# EasyEDA Pro project ProPrj_FAB-O-MATIC-rev1.3_2024-08-18.epro

# Schematic FAB-O-MATIC

## Sheets
1 Schematics: Board Name: FAB-O-MATIC; Create Date: 2024-08-17; Page Name: Schematics; Project Name: FAB-O-MATIC-rev1.3; Schematic Name: FAB-O-MATIC; Update Date: 2024-08-21; Date: August, 2024; REV: 1.3
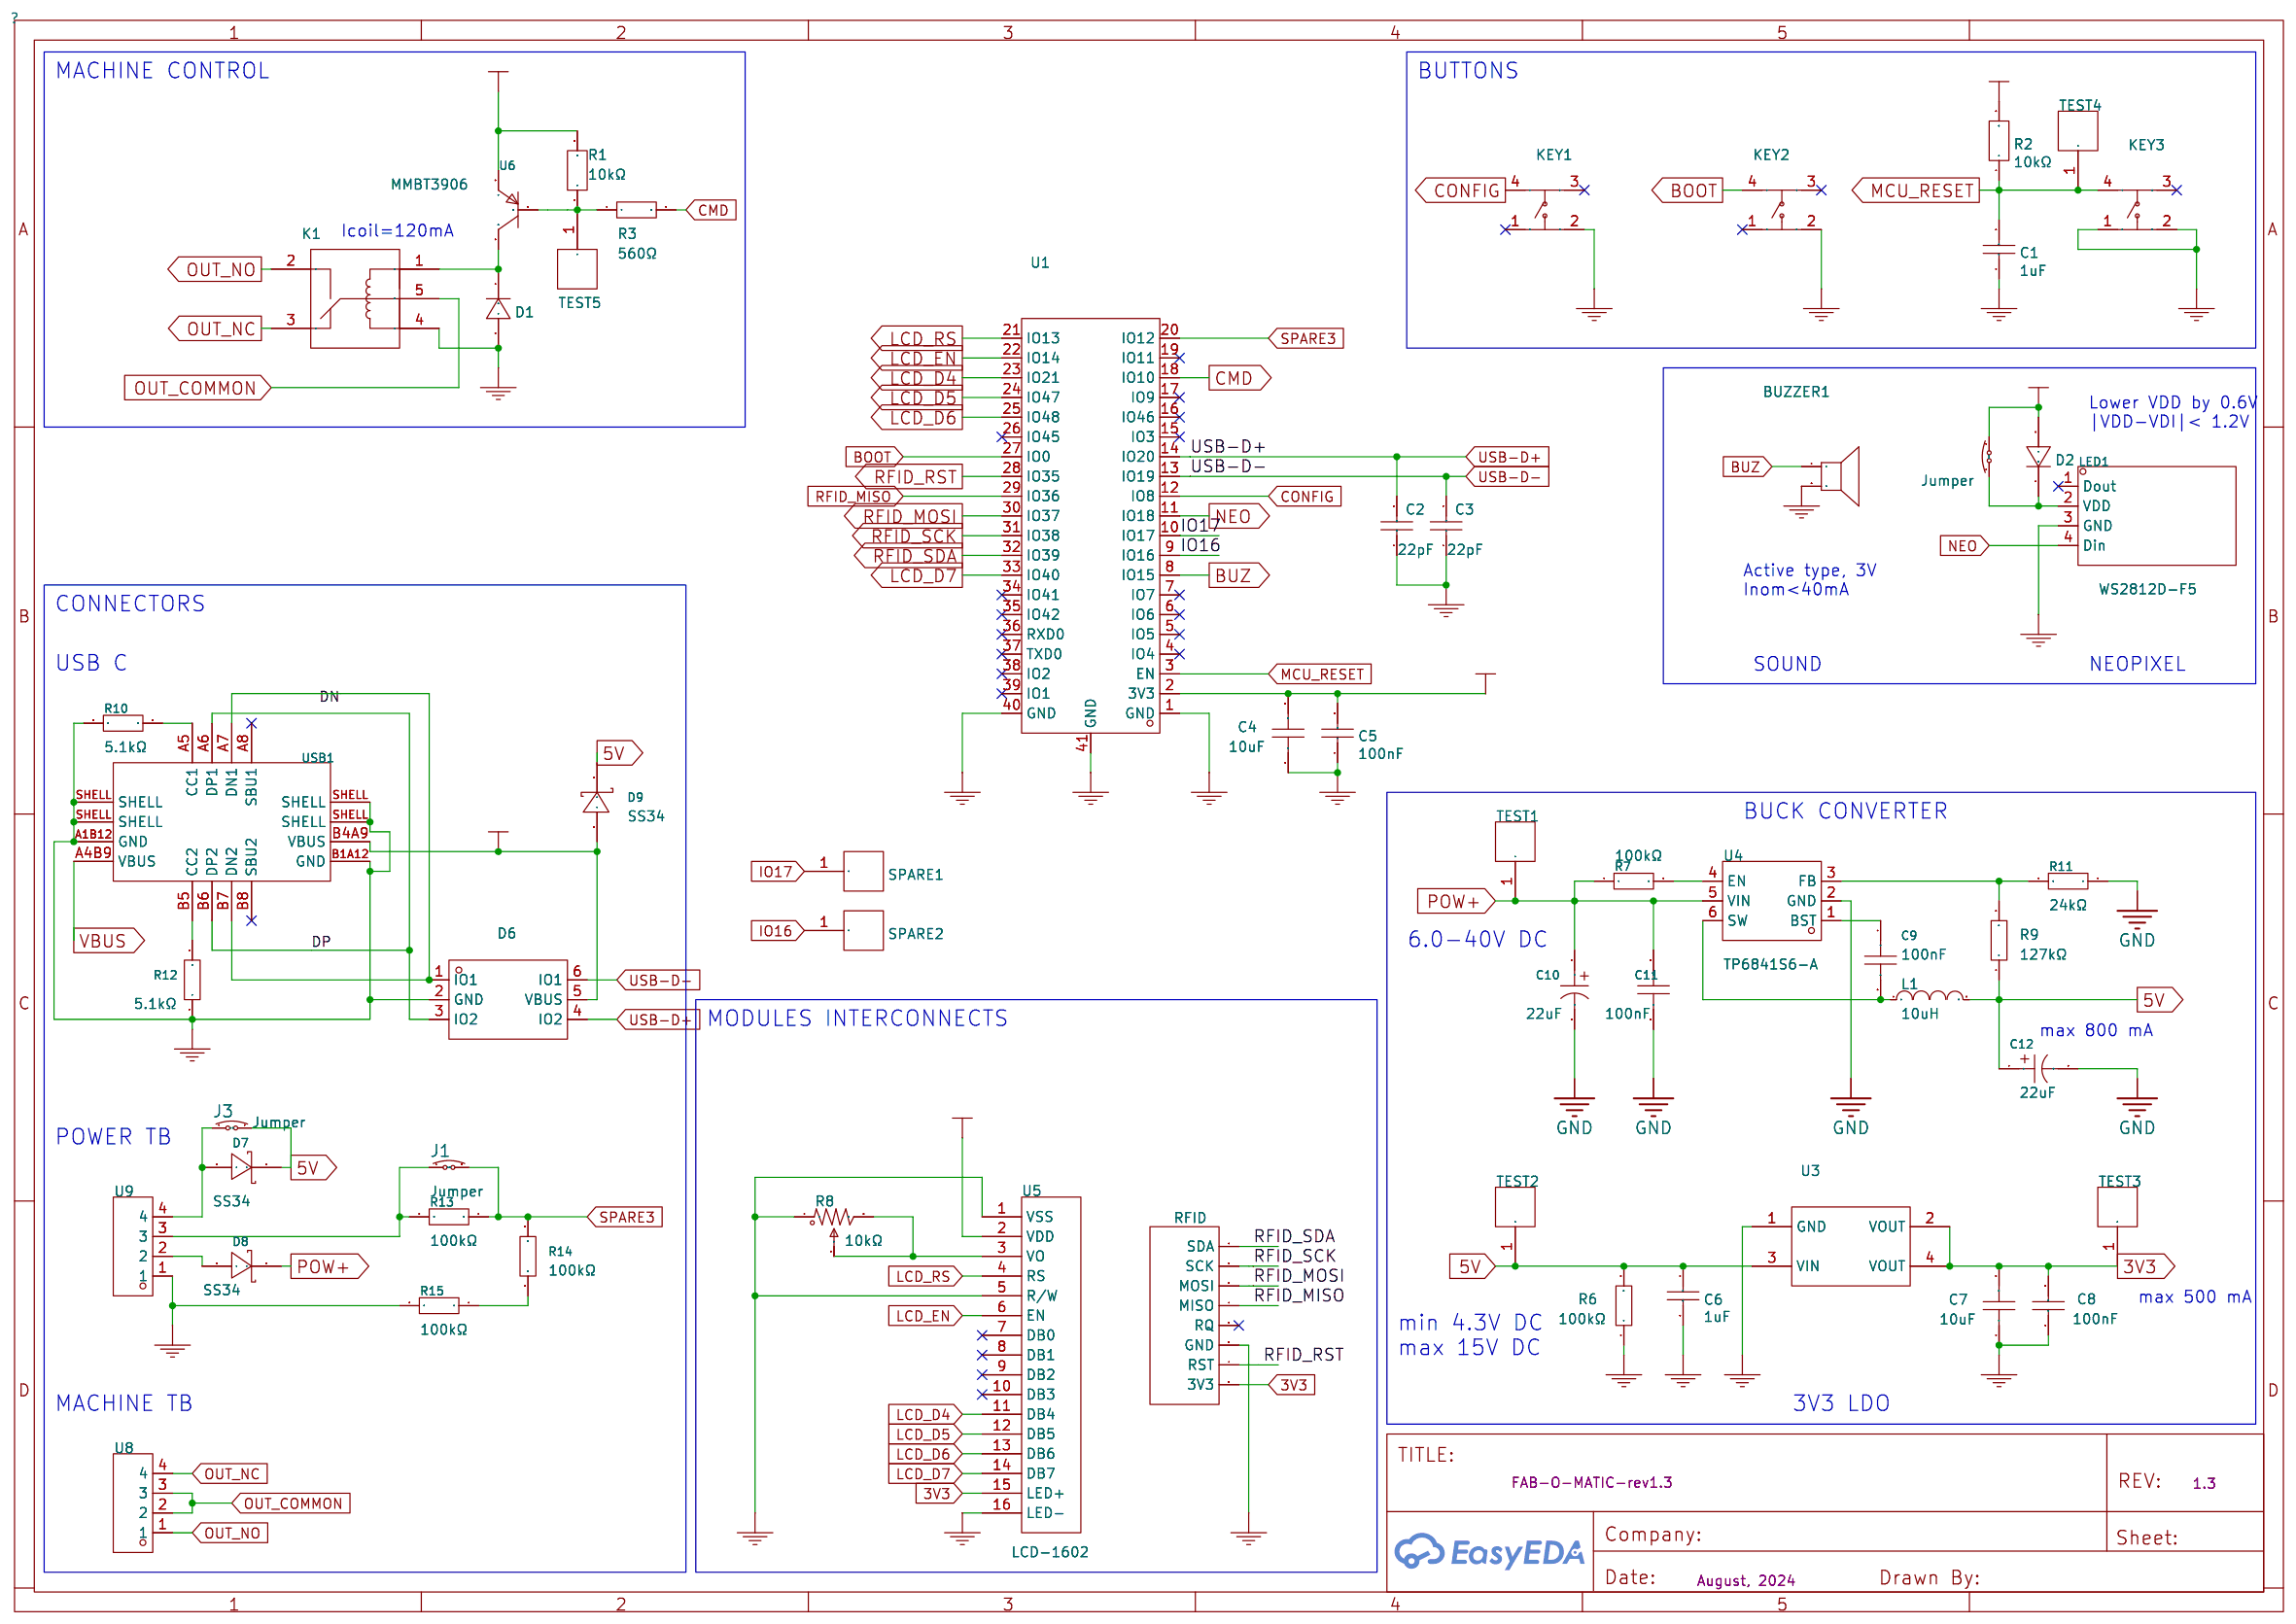
[diagram p0: Schematics]
2 Notes: Page Name: Notes; Update Date: 2024-08-17; Company: FabLab BG; Drawn: PBrunot
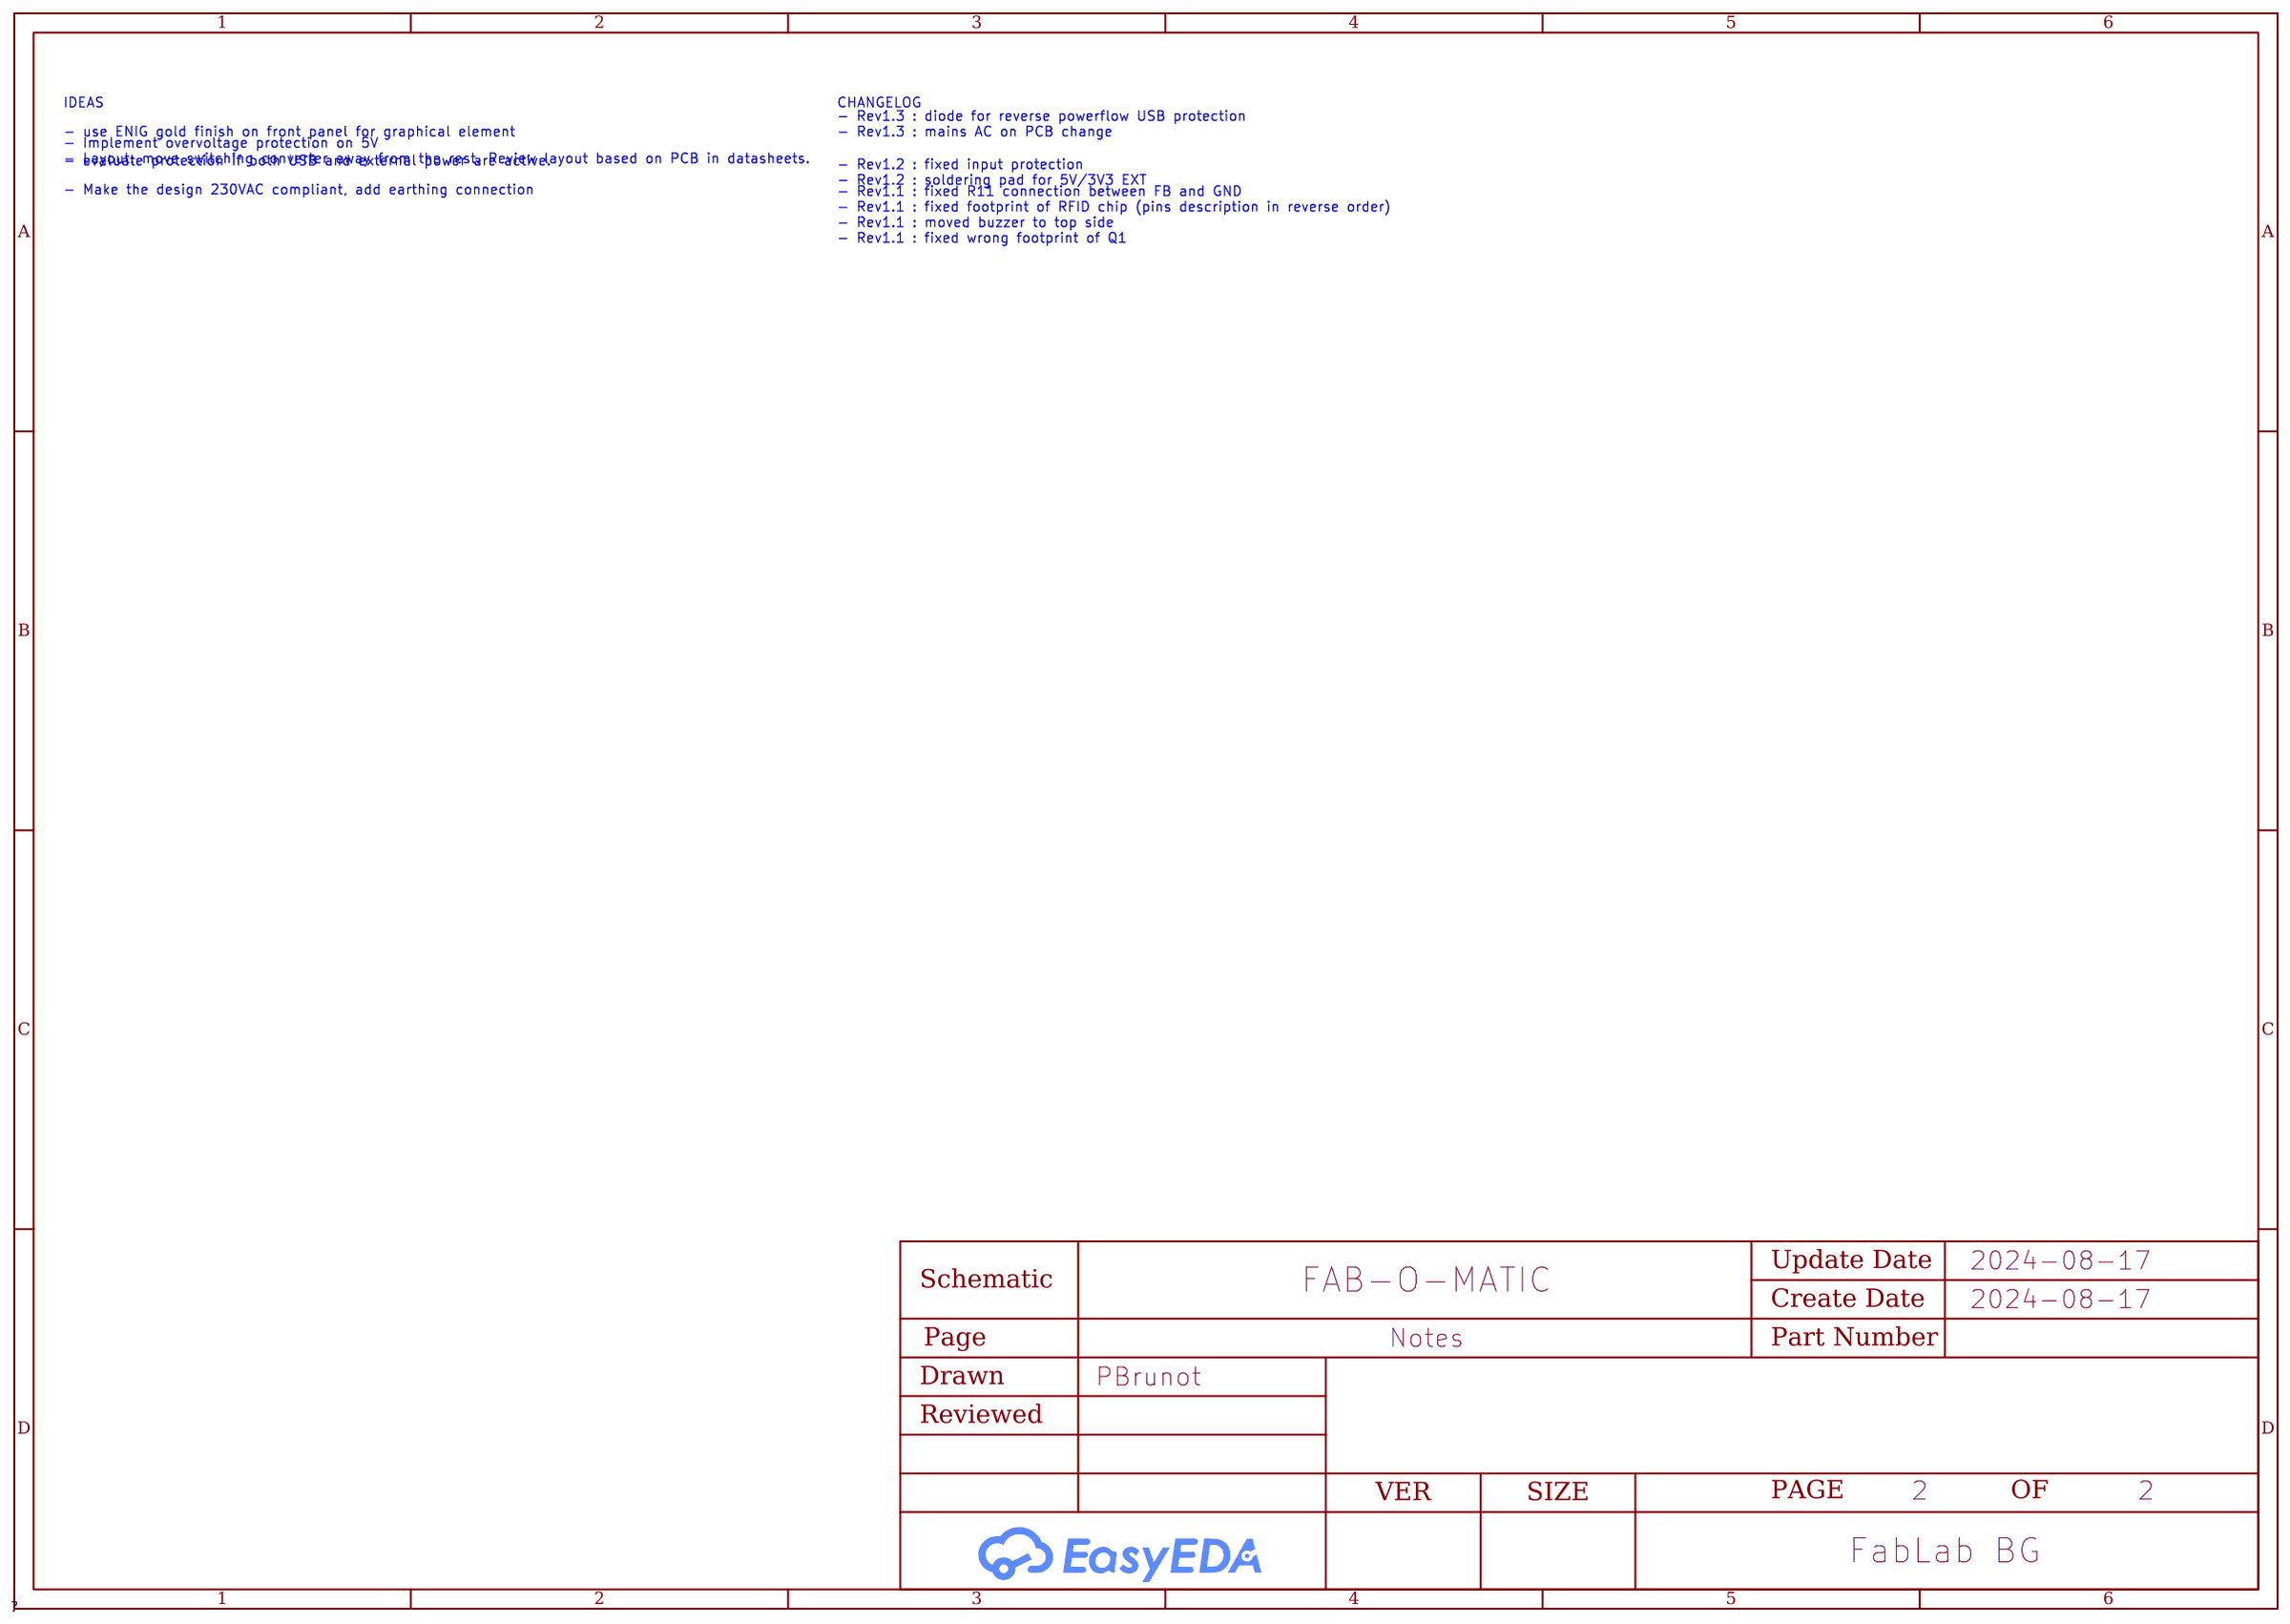
[diagram p1: Notes]

## Parts
BUZZER1  4kHz  [BUZ-TH_BD12.5-P6.50-D0.9]
C1  1uF  [C0805]
C2  22pF  [C0603]
C3  22pF  [C0603]
C4  10uF  [C0805]
C5  100nF  [C0805]
C6  1uF  [C0805]
C7  10uF  [C0805]
C8  100nF  [C0805]
C9  100nF  [C0603]
C10  22uF  [CAP-SMD_BD6.3-L6.6-W6.6-FD]
C11  100nF  [C0603]
C12  22uF  [CAP-SMD_BD6.3-L6.6-W6.6-FD]
D1  SM4007PL  [SOD-123F_L2.8-W1.8-LS3.7-RD]
D2  SM4007PL  [SOD-123F_L2.8-W1.8-LS3.7-RD]
D6  USBLC6-2SC6  [SOT-23-6_L2.9-W1.6-P0.95-LS2.8-BL]
D7  SS34  [SMA_L4.3-W2.6-LS5.2-RD]
D8  SS34  [SMA_L4.3-W2.6-LS5.2-RD]
D9  SS34  [SMA_L4.3-W2.6-LS5.2-RD]
J1  Jumper  [JUMPER]
J2  Jumper  [JUMPER]
J3  Jumper  [JUMPER]
K1  SRD-03VDC-SL-C  [RELAY-TH_SRD-03VDC-SL-C]
KEY1  TSA063G60-250  [KEY-SMD_4P-L6.1-W6.1-P4.50-LS9.0]
KEY2  TSA063G60-250  [KEY-SMD_4P-L6.1-W6.1-P4.50-LS9.0]
KEY3  TSA063G60-250  [KEY-SMD_4P-L6.1-W6.1-P4.50-LS9.0]
L1  10uH  [IND-SMD_L4.0-W4.0]
LED1  WS2812D-F5  [LED-TH_4P-BD5.8-P1.30]
P1  RFID  [footprint_17af]
R1  10kΩ  [R0805]
R2  10kΩ  [R0805]
R3  560Ω  [R0805]
R6  100kΩ  [R0805]
R7  100kΩ  [R0603]
R8  10kΩ  [RES-ADJ-TH_3362P]
R9  127kΩ  [R0603]
R10  5.1kΩ  [R0603]
R11  24kΩ  [R0603]
R12  5.1kΩ  [R0603]
R13  100kΩ  [R0603]
R14  100kΩ  [R0603]
R15  100kΩ  [R0603]
SPARE1  0577-0-43-80-21-27-10-0  [footprint_662d]  (no BOM)
SPARE2  0577-0-43-80-21-27-10-0  [footprint_662d]  (no BOM)
TEST1  0577-0-43-80-21-27-10-0  [footprint_662d]  (no BOM)
TEST2  0577-0-43-80-21-27-10-0  [footprint_662d]  (no BOM)
TEST3  0577-0-43-80-21-27-10-0  [footprint_662d]  (no BOM)
TEST4  0577-0-43-80-21-27-10-0  [footprint_662d]  (no BOM)
TEST5  0577-0-43-80-21-27-10-0  [footprint_662d]  (no BOM)
U1  ESP32-S3-WROOM-1-N4R8  [WIRELM-SMD_ESP32-S3-WROOM-1]
U3  LD1117S33TR  [SOT-223_L6.5-W3.5-P2.30-LS7.0-BR]
U4  TP6841S6-A  [SOT-23-6_L2.9-W1.6-P0.95-LS2.8-BL]
U5  LCD-1602  [footprint_8a57]
U6  MMBT3906  [SOT-23-3_L2.9-W1.3-P1.90-LS2.4-BR]
U8  DB103-5.0-4P-GN-S  [CONN-TH_4P-P5.00_DB103-5.0-4P-GN-S]
U9  DB103-5.0-4P-GN-S  [CONN-TH_4P-P5.00_DB103-5.0-4P-GN-S]
USB1  U262-161N-4BVC11  [USB-3.1-SMD_U262-161N-4BVC11]

## Library data of the parts
BUZZER1 = SFN-12055PA6.5_C360607: Oscillator Circuit:无源(外部驱动) Technology Type:压电式 Frequency:4kHz Sound Pressure Level (SPL):80dB@5V,10cm Diameter (φD):12.5mm Height:6mm; LCSC Part Name: 压电无源蜂鸣器; Supplier Part: C360607; Manufacturer: S&S(海旭); Manufacturer Part: SFN-12055PA6.5; Supplier Footprint: 插件,D=12.5mm; JLCPCB Part Class: Extended Part; Datasheet: https://atta.szlcsc.com/upload/public/pdf/source/20220225/D801AF3A55A67CFB490E002F7E7725D1.pdf; Supplier: LCSC; Oscillator Circuit: 无源(外部驱动); Technology Type: 压电式; Sound Pressure Level (SPL): 80dB@5V,10cm; Diameter (φD): 12.5mm; Height: 6mm
C1 C6 = CL21B105KBFNNNE: Capacitance: Tolerance:±10% Tolerance:±10% Voltage Rated: Temperature Coefficient:; LCSC Part Name: 1uF ±10% 50V; Supplier Part: C28323; Manufacturer: SAMSUNG(三星); Supplier Footprint: 0805; JLCPCB Part Class: Basic Part; Datasheet: https://atta.szlcsc.com/upload/public/pdf/source/20160218/1457707763339.pdf; Supplier: LCSC; Tolerance: ±10%
C2 C3 = CL10C220JB8NNNC: Capacitance: Tolerance:±5% Tolerance:±5% Voltage Rated: Temperature Coefficient:; LCSC Part Name: 22pF ±5% 50V; Supplier Part: C1653; Manufacturer: SAMSUNG(三星); Supplier Footprint: 0603; JLCPCB Part Class: Basic Part; Datasheet: https://atta.szlcsc.com/upload/public/pdf/source/20160218/1457707763339.pdf; Supplier: LCSC; Tolerance: ±5%
C4 C7 = GRM21BR61H106KE43L: Capacitance: Tolerance:±10% Tolerance:±10% Voltage Rated: Temperature Coefficient:; LCSC Part Name: 10uF ±10% 50V; Supplier Part: C440198; Manufacturer: muRata(村田); Supplier Footprint: 0805; JLCPCB Part Class: Basic Part; Datasheet: https://atta.szlcsc.com/upload/public/pdf/source/20230811/95AAE0C9AF55EDC31B7A4D8B733F534E.pdf; Supplier: LCSC; Tolerance: ±10%
C5 C8 = CL21B104KCFNNNE: Capacitance: Tolerance:±10% Tolerance:±10% Voltage Rated: Temperature Coefficient:; LCSC Part Name: 100nF ±10% 100V; Supplier Part: C28233; Manufacturer: SAMSUNG(三星); Supplier Footprint: 0805; JLCPCB Part Class: Basic Part; Datasheet: https://atta.szlcsc.com/upload/public/pdf/source/20160218/1457707763339.pdf; Supplier: LCSC; Tolerance: ±10%
C9 C11 = CC0603KRX7R9BB104: Capacitance: Tolerance:±10% Tolerance:±10% Voltage Rated: Temperature Coefficient:; LCSC Part Name: 100nF ±10% 50V; Supplier Part: C14663; Manufacturer: YAGEO(国巨); Supplier Footprint: 0603; JLCPCB Part Class: Basic Part; Datasheet: https://atta.szlcsc.com/upload/public/pdf/source/20180910/C282072_33301C7F631E79921B82A8DAC6BCC5B3.pdf; Supplier: LCSC; Tolerance: ±10%
C10 C12 = RVT22UF50V67RV0028: Capacitance: Tolerance:±20% Tolerance:±20% Rated Voltage: Ripple Current:43mA@120Hz Equivalent Series Resistance(ESR):- φD: L: Lifetime @ Temp:2000hrs@105℃ Operating Temperature:-55℃~+105℃ Operating Temperature:-55℃~+105℃; LCSC Part Name: 22uF ±20% 50V; Supplier Part: C2836438; Manufacturer: KNSCHA(科尼盛); Supplier Footprint: SMD,D6.3xL5.4mm; JLCPCB Part Class: Extended Part; Datasheet: https://atta.szlcsc.com/upload/public/pdf/source/20210528/C2836438_BFA13B3627CC6B20ADD0B3BB98082A71.pdf; Supplier: LCSC; Tolerance: ±20%; Ripple Current: 43mA@120Hz; Lifetime @ Temp: 2000hrs@105℃; Operating Temperature: -55℃~+105℃
D1 D2 = SM4007PL_C64898: Diode Configuration: Forward Voltage (Vf@If):1.1V@1A Reverse Voltage (Vr): Average Rectified Current (Io): Reverse Leakage Current:10uA@1kV; LCSC Part Name: 电压:1kV 电流:1A; Supplier Part: C64898; Manufacturer: MDD; Supplier Footprint: SOD-123FL; JLCPCB Part Class: Basic Part; Datasheet: https://atta.szlcsc.com/upload/public/pdf/source/20230823/16A8FDE162764C9B685A3717F2DA3690.pdf; Supplier: LCSC; Forward Voltage (Vf@If): 1.1V@1A; Reverse Leakage Current: 10uA@1kV
D6 = USBLC6-2SC6_C2827654: polarity:- Reverse Stand-Off Voltage (Vrwm):- Maximum Clamping Voltage:- Peak Pulse Current (Ipp)@10/1000us:- Peak Pulse Power Dissipation (Ppp)@10/1000us:- Breakdown Voltage:- Reverse Leakage Current (Ir):- Operating Temperature:- Operating Temperature:-; LCSC Part Name: ESD，可防30kV静电; Supplier Part: C2827654; Manufacturer: TECH PUBLIC(台舟); Supplier Footprint: SOT-23-6; JLCPCB Part Class: Extended Part; Datasheet: https://atta.szlcsc.com/upload/public/pdf/source/20210810/FBD75DE717D6D97BAC6DD7F2B5C09DCD.pdf; Supplier: LCSC; Type: ESD
D7-D9 = SS34_C8678: Diode Configuration:Single Forward Voltage (Vf@If):550mV@3A Reverse Voltage (Vr):40V Average Rectified Current (Io):3A Reverse Leakage Current (Ir):500uA@40V; LCSC Part Name: 电压:40V 电流:3A; Supplier Part: C8678; Manufacturer: MDD; Supplier Footprint: SMA(DO-214AC); JLCPCB Part Class: Basic Part; Datasheet: https://atta.szlcsc.com/upload/public/pdf/source/20230314/A80AE34493C69B89E2F4B1712F433538.pdf; Supplier: LCSC; Diode Configuration: Single; Forward Voltage (Vf@If): 550mV@3A; Reverse Voltage (Vr): 40V; Average Rectified Current (Io): 3A; Reverse Leakage Current (Ir): 500uA@40V
J1-J3 = Jumper
K1 = SRD-03VDC-SL-C: Coil Voltage:3V Contact Form:一组转换:1C(SPDT-转换) Pin Number:5 Contact Rating:- Maximum Switching Voltage:250V@AC Coil Rated Power:360mW Maximum Switching Current:15A Coil Type:无极性-单线圈 Contact Resistance:100mΩ Operate Time:10ms Release Time:10ms; LCSC Part Name: 3V继电器 单刀双掷 蓝色; Supplier Part: C496430; Manufacturer: 松乐; Supplier Footprint: 插件,15.6x19.2mm; JLCPCB Part Class: Extended Part; Datasheet: https://atta.szlcsc.com/upload/public/pdf/source/20211029/0AF1F09028F3938DCCE87F54F358E4BA.pdf; Supplier: LCSC; Coil Voltage: 3V; Contact Form: 一组转换:1C(SPDT-转换); Pin Number: 5; Maximum Switching Voltage: 250V@AC; Coil Rated Power: 360mW; Maximum Switching Current: 15A; Coil Type: 无极性-单线圈; Contact Resistance: 100mΩ; Operate Time: 10ms; Release Time: 10ms
KEY1-KEY3 = TSA063G60-250: Circuit:SPST Actuator Style:Round Button Operating Force:250gf Mounting Style:Brick nogging Switch Length:6.1mm Switch Width:6.1mm Switch Height:6mm Strike Gundam:不带 Contact Current:50mA Voltage Rating (DC):12V Insulation Resistance:100MΩ Actuator/Cap Col; LCSC Part Name: 6.1*6.1*6mm 立贴 轻触开关; Supplier Part: C294566; Manufacturer: BRIGHT(博瑞泰); Supplier Footprint: SMD; JLCPCB Part Class: Extended Part; Datasheet: https://atta.szlcsc.com/upload/public/pdf/source/20181029/C294570_15EFF1F4D215547575AD6307D8A439BB.pdf; Supplier: LCSC; Circuit: SPST; Actuator Style: Round Button; Operating Force: 250gf; Mounting Style: Brick nogging; Switch Length: 6.1mm; Switch Width: 6.1mm; Switch Height: 6mm; Strike Gundam: 不带; Contact Current: 50mA; Voltage Rating (DC): 12V; Insulation Resistance: 100MΩ; Actuator/Cap Color: Black; With Lamp: No; Pin Style: Gull Wing; Mechanical Life: 5万次; Operating Temperature: -25℃~+70℃
L1 = SWPA4030S100MT: Inductance: Tolerance:±20% Tolerance:±20% Rated Current: Saturation Current (Isat):2.4A DC Resistance (DCR): Type:- Ratings:-; LCSC Part Name: 10uH ±20% 2.4A; Supplier Part: C38117; Manufacturer: Sunlord(顺络); Supplier Footprint: SMD; JLCPCB Part Class: Extended Part; Datasheet: https://atta.szlcsc.com/upload/public/pdf/source/20231024/317626D2AA2F8AB4113C1875E432E6E1.pdf; Supplier: LCSC; Tolerance: ±20%; Saturation Current (Isat): 2.4A
LED1 = WS2812D-F5: Lamp Holder Type:5mm圆形灯头; Supplier Part: C190565; Manufacturer: worldsemi; Supplier Footprint: 插件,D=5mm; JLCPCB Part Class: Extended Part; Datasheet: https://atta.szlcsc.com/upload/public/pdf/source/20220418/4832EF9FB0C1B68C1F4176435955B165.pdf; Supplier: LCSC; Lamp Holder Type: 5mm圆形灯头
P1 = RFID: Supplier Part: C27438; Supplier: LCSC; Manufacturer: BOOMELE; Manufacturer Part: Female headerHDR1X8-2.54
R1 R2 = 0805W8F1002T5E: Type:Thick Film Resistors Resistance:10kΩ Tolerance:±1% Tolerance:±1% Power(Watts): Overload Voltage (Max): Temperature Coefficient:±100ppm/℃ Temperature Coefficient:±100ppm/℃ Operating Temperature Range:-55℃~+155℃ Operating Temperature Range:-55℃~+155℃; LCSC Part Name: 10kΩ ±1% 125mW 厚膜电阻; Supplier Part: C17414; Manufacturer: UNI-ROYAL(厚声); Supplier Footprint: 0805; JLCPCB Part Class: Basic Part; Datasheet: https://atta.szlcsc.com/upload/public/pdf/source/20200306/C422600_1E6D84923E4A46A82E41ADD87F860B5C.pdf; Supplier: LCSC; Type: Thick Film Resistors; Tolerance: ±1%; Temperature Coefficient: ±100ppm/℃; Operating Temperature Range: -55℃~+155℃
R3 = 0805W8F5600T5E: Type:Thick Film Resistors Resistance: Tolerance:±1% Tolerance:±1% Power(Watts): Overload Voltage (Max): Temperature Coefficient:±100ppm/℃ Temperature Coefficient:±100ppm/℃ Operating Temperature Range:-55℃~+155℃ Operating Temperature Range:-55℃~+155℃; LCSC Part Name: 560Ω ±1% 125mW 厚膜电阻; Supplier Part: C28636; Manufacturer: UNI-ROYAL(厚声); Supplier Footprint: 0805; JLCPCB Part Class: Basic Part; Datasheet: https://atta.szlcsc.com/upload/public/pdf/source/20200306/C422600_1E6D84923E4A46A82E41ADD87F860B5C.pdf; Supplier: LCSC; Type: Thick Film Resistors; Tolerance: ±1%; Temperature Coefficient: ±100ppm/℃; Operating Temperature Range: -55℃~+155℃
R6 = 0805W8F1003T5E: Type:Thick Film Resistors Resistance:100kΩ Tolerance:±1% Tolerance:±1% Power(Watts): Overload Voltage (Max): Temperature Coefficient:±100ppm/℃ Temperature Coefficient:±100ppm/℃ Operating Temperature Range:-55℃~+155℃ Operating Temperature Range:-55℃~+155℃; LCSC Part Name: 100kΩ ±1% 125mW 厚膜电阻; Supplier Part: C149504; Manufacturer: UNI-ROYAL(厚声); Supplier Footprint: 0805; JLCPCB Part Class: Basic Part; Datasheet: https://atta.szlcsc.com/upload/public/pdf/source/20200306/C422600_1E6D84923E4A46A82E41ADD87F860B5C.pdf; Supplier: LCSC; Type: Thick Film Resistors; Tolerance: ±1%; Temperature Coefficient: ±100ppm/℃; Operating Temperature Range: -55℃~+155℃
R7 R13-R15 = 0603WAF1003T5E: Type:Thick Film Resistors Resistance:100kΩ Tolerance:±1% Tolerance:±1% Power(Watts): Overload Voltage (Max): Temperature Coefficient:±100ppm/℃ Temperature Coefficient:±100ppm/℃ Operating Temperature Range:-55℃~+155℃ Operating Temperature Range:-55℃~+155℃; LCSC Part Name: 100kΩ ±1% 100mW 厚膜电阻; Supplier Part: C25803; Manufacturer: UNI-ROYAL(厚声); Supplier Footprint: 0603; JLCPCB Part Class: Basic Part; Datasheet: https://atta.szlcsc.com/upload/public/pdf/source/20200306/C422600_1E6D84923E4A46A82E41ADD87F860B5C.pdf; Supplier: LCSC; Type: Thick Film Resistors; Tolerance: ±1%; Temperature Coefficient: ±100ppm/℃; Operating Temperature Range: -55℃~+155℃
R8 = 3362P-1-103_C118956: Resistance: Tolerance:±10% Tolerance:±10%; LCSC Part Name: 10kΩ ±10%; Supplier Part: C118956; Manufacturer: BOCHEN(博晨); Manufacturer Part: 3362P-1-103; Supplier Footprint: 插件; JLCPCB Part Class: Extended Part; Datasheet: https://atta.szlcsc.com/upload/public/pdf/source/20171114/C118956_15106326650691117445.pdf; Supplier: LCSC; Tolerance: ±10%
R9 = RC0603FR-07127KL: Type:Thick Film Resistors Resistance: Tolerance:±1% Tolerance:±1% Power(Watts): Overload Voltage (Max): Temperature Coefficient:±100ppm/℃ Temperature Coefficient:±100ppm/℃ Operating Temperature Range:-55℃~+155℃ Operating Temperature Range:-55℃~+155℃; LCSC Part Name: 厚膜电阻 127kΩ ±1% 100mW; Supplier Part: C245905; Manufacturer: YAGEO(国巨); Supplier Footprint: 0603; JLCPCB Part Class: Extended Part; Datasheet: https://atta.szlcsc.com/upload/public/pdf/source/20181031/C326976_E9901E35333D136A19B6CE377E889A82.pdf; Supplier: LCSC; Type: Thick Film Resistors; Tolerance: ±1%; Temperature Coefficient: ±100ppm/℃; Operating Temperature Range: -55℃~+155℃
R10 R12 = 0603WAF5101T5E: Type:Thick Film Resistors Resistance:5.1kΩ Tolerance:±1% Tolerance:±1% Power(Watts): Overload Voltage (Max): Temperature Coefficient:±100ppm/℃ Temperature Coefficient:±100ppm/℃ Operating Temperature Range:-55℃~+155℃ Operating Temperature Range:-55℃~+155℃; LCSC Part Name: 5.1kΩ ±1% 100mW 厚膜电阻; Supplier Part: C23186; Manufacturer: UNI-ROYAL(厚声); Supplier Footprint: 0603; JLCPCB Part Class: Basic Part; Datasheet: https://atta.szlcsc.com/upload/public/pdf/source/20200306/C422600_1E6D84923E4A46A82E41ADD87F860B5C.pdf; Supplier: LCSC; Type: Thick Film Resistors; Tolerance: ±1%; Temperature Coefficient: ±100ppm/℃; Operating Temperature Range: -55℃~+155℃
R11 = 0603WAF2402T5E: Type:Thick Film Resistors Resistance:24kΩ Tolerance:±1% Tolerance:±1% Power(Watts): Overload Voltage (Max): Temperature Coefficient:±100ppm/℃ Temperature Coefficient:±100ppm/℃ Operating Temperature Range:-55℃~+155℃ Operating Temperature Range:-55℃~+155℃; LCSC Part Name: 24kΩ ±1% 100mW 厚膜电阻; Supplier Part: C23352; Manufacturer: UNI-ROYAL(厚声); Supplier Footprint: 0603; JLCPCB Part Class: Basic Part; Datasheet: https://atta.szlcsc.com/upload/public/pdf/source/20200306/C422600_1E6D84923E4A46A82E41ADD87F860B5C.pdf; Supplier: LCSC; Type: Thick Film Resistors; Tolerance: ±1%; Temperature Coefficient: ±100ppm/℃; Operating Temperature Range: -55℃~+155℃
SPARE1 SPARE2 TEST1-TEST5 = 0577-0-43-80-21-27-10-0: Supplier: LCSC; Supplier Part: C2895400; Manufacturer: null; JLCPCB Part Class: Extended Part
U1 = ESP32-S3-WROOM-1-N4R8: LCSC Part Name: 通用型Wi-Fi+低功耗蓝牙MCU模组; Supplier Part: C2913200; Manufacturer: ESPRESSIF(乐鑫); Supplier Footprint: SMD,18x25.5mm; JLCPCB Part Class: Extended Part; Datasheet: https://atta.szlcsc.com/upload/public/pdf/source/20220628/A2AC12B3C87735CAEB7EBE2DBE80936C.pdf; Supplier: LCSC; spicePre: U
U3 = LD1117S33TR: Output Type: Maximum Input Voltage:15V Output Voltage:3.3V Output Voltage:3.3V MAX Output Current:800mA Power Supply Rejection Ratio (PSRR):75dB@(120Hz) Dropout Voltage:1.2V@(800mA) standby current:10mA Operating Temperature:0℃~+125℃ Operating Temperature; LCSC Part Name: 输入15V 输出3.3V 800mA; Supplier Part: C86781; Manufacturer: ST(意法半导体); Supplier Footprint: SOT-223; JLCPCB Part Class: Extended Part; Datasheet: https://atta.szlcsc.com/upload/public/pdf/source/20181022/C283467_00098992BB1D287195B66486CE33A2DD.pdf; Supplier: LCSC; Maximum Input Voltage: 15V; Output Voltage: 3.3V; MAX Output Current: 800mA; Power Supply Rejection Ratio (PSRR): 75dB@(120Hz); Dropout Voltage: 1.2V@(800mA); standby current: 10mA; Operating Temperature: 0℃~+125℃; Output Polarity: Positive electrode; Number of Outputs: 1
U4 = TP6841S6-A: Supplier Part: C2844924; Manufacturer: TECH PUBLIC(台舟); Supplier Footprint: SOT-23-6; JLCPCB Part Class: Extended Part; Datasheet: https://atta.szlcsc.com/upload/public/pdf/source/20210709/C2844924_E200F0B809810750A1B5AEDD4B4FD840.pdf; Supplier: LCSC
U5 = LCD-1602: Manufacturer Part: ?
U6 = MMBT3906_C7420354: Transistor Type:PNP Collector Current (Ic):200mA Collector-Emitter Breakdown Voltage (Vceo):40V Power Dissipation (Pd): DC Current Gain (hFE@Ic,Vce):100@10mA,1.0V DC Current Gain (hFE@Ic,Vce):100@10mA,1.0V Transition Frequency (fT):300MHz Collector Cut-Of; LCSC Part Name: 耐压:40V 电流:200mA PNP; Supplier Part: C7420354; Manufacturer: 宏迦橙; Supplier Footprint: SOT-23; JLCPCB Part Class: Extended Part; Datasheet: https://atta.szlcsc.com/upload/public/pdf/source/20231222/C57AF7F09D8B4437DE7730975D81C46C.pdf; Supplier: LCSC; Transistor Type: PNP; Collector Current (Ic): 200mA; Collector-Emitter Breakdown Voltage (Vceo): 40V; DC Current Gain (hFE@Ic,Vce): 100@10mA,1.0V; Transition Frequency (fT): 300MHz; Collector Cut-Off Current (Icbo): 100nA; Collector-Emitter Saturation Voltage (VCE(sat)@Ic,Ib): 300mV@50mA,5.0mA; Operating Temperature: -55℃~+150℃
U8 U9 = DB103-5.0-4P-GN-S: Structure:1x4P Pitch:5mm Color:Green Mounting Style:Straight Current Rating (Max):18A Voltage Rating (Max):250V Number of Pins:4P Number of Rows:1 Wire Gauge - AWG:12~24 Wire Gauge - AWG:12~24 Wire Gauge - mm2:2.5 Wire Gauge - mm2:2.5 Number of PINs Per R; LCSC Part Name: 5mm 1x4P 排数:1 每排P数:4 直插; Supplier Part: C430585; Manufacturer: DORABO(地博电气); Supplier Footprint: 插件,P=5mm; JLCPCB Part Class: Extended Part; Datasheet: https://atta.szlcsc.com/upload/public/pdf/source/20230106/752C703EF48364998289896F4CC52B88.pdf; Supplier: LCSC; Structure: 1x4P; Pitch: 5mm; Color: Green; Mounting Style: Straight; Current Rating (Max): 18A; Voltage Rating (Max): 250V; Number of Pins: 4P; Number of Rows: 1; Wire Gauge - AWG: 12~24; Wire Gauge - mm2: 2.5; Number of PINs Per Row: 4; Operating Temperature Range: -40℃~+105℃
USB1 = U262-161N-4BVC11: Connector Type:Type-C Standard:USB 3.1 Gender:Female Number of Ports:1 Number of Contacts:16P Mounting Style:卧贴 Current Rating - Power (Max):3A Contact Material:Copper Alloy Contact Plating:Gold Operating Temperature Range:-40℃~+85℃ Operating Temperature; LCSC Part Name: Type-C 母 卧贴; Supplier Part: C319148; Manufacturer: XKB Connectivity(中国星坤); Supplier Footprint: SMD; JLCPCB Part Class: Extended Part; Datasheet: https://atta.szlcsc.com/upload/public/pdf/source/20211015/B478CBA0F1623DA36A6CC6918C49C838.pdf; Supplier: LCSC; Connector Type: Type-C; Standard: USB 3.1; Gender: Female; Number of Ports: 1; Number of Contacts: 16P; Mounting Style: 卧贴; Current Rating - Power (Max): 3A; Contact Material: Copper Alloy; Contact Plating: Gold; Operating Temperature Range: -40℃~+85℃; Soldering Temperature(Max): 260℃

## Nets
3V3: C4.2 C5.2 C7.2 C8.2 P1.8(3V3) R1.2 R2.2 TEST3.1 U1.2(3V3) U3.2(VOUT) U3.4(VOUT) U5.15(LED+) U6.2(E)
5V: C6.1 C12.1 D2.2(A) D7.1(K) D9.1(K) J2.2 J3.2 L1.2 R6.2 R9.1 TEST2.1 U3.3(VIN) U5.2(VDD)
GND: BUZZER1.2 C1.1 C2.1 C3.1 C4.1 C5.1 C6.2 C7.1 C8.1 C10.2 C11.1 C12.2 D1.2(A) D6.2(GND) K1.4 KEY1.2 KEY2.2 KEY3.1 KEY3.2 LED1.3(GND) P1.6(GND) R6.1 R8.1 R10.2 R11.1 R12.1 R15.2 U1.1(GND) U1.40(GND) U1.41(GND) U3.1(GND) U4.2(GND) U5.1(VSS) U5.5(R/W) U5.16(LED-) U9.1 USB1.A1B12(GND) USB1.B1A12(GND) USB1.SHELL
VBUS: D6.5(VBUS) D9.2(A) USB1.A4B9(VBUS) USB1.B4A9(VBUS)
BOOT: KEY2.4 U1.27(IO0)
BUZ: BUZZER1.1 U1.8(IO15)
CMD: R3.2 U1.18(IO10)
CONFIG: KEY1.4 U1.12(IO8)
DN: D6.1(IO1) USB1.A7(DN1) USB1.B7(DN2)
DP: D6.3(IO2) USB1.A6(DP1) USB1.B6(DP2)
IO16: SPARE2.1 U1.9(IO16)
IO17: SPARE1.1 U1.10(IO17)
LCD_D4: U1.23(IO21) U5.11(DB4)
LCD_D5: U1.24(IO47) U5.12(DB5)
LCD_D6: U1.25(IO48) U5.13(DB6)
LCD_D7: U1.33(IO40) U5.14(DB7)
LCD_EN: U1.22(IO14) U5.6(EN)
LCD_RS: U1.21(IO13) U5.4(RS)
MCU_RESET: C1.2 KEY3.4 R2.1 TEST4.1 U1.3(EN)
NEO: LED1.4(Din) U1.11(IO18)
OUT_COMMON: K1.5 U8.2 U8.3
OUT_NC: K1.3 U8.4
OUT_NO: K1.2 U8.1
POW+: C10.1 C11.2 D8.1(K) R7.1 TEST1.1 U4.5(VIN)
RFID_MISO: P1.4(MISO) U1.29(IO36)
RFID_MOSI: P1.3(MOSI) U1.30(IO37)
RFID_RST: P1.7(RST) U1.28(IO35)
RFID_SCK: P1.2(SCK) U1.31(IO38)
RFID_SDA: P1.1(SDA) U1.32(IO39)
SPARE3: J1.2 R13.1 R14.2 U1.20(IO12)
USB-D+: C2.2 D6.4(IO2) U1.14(IO20)
USB-D-: C3.2 D6.6(IO1) U1.13(IO19)
$1N85: D1.1(C) K1.1 U6.3(C)
$1N86: R1.1 R3.1 TEST5.1 U6.1(B)
$1N90: D2.1(C) J2.1 LED1.2(VDD)
$1N15737: C9.1 U4.1(BST)
$1N15956: R7.2 U4.4(EN)
$1N24952: R12.2 USB1.B5(CC2)
$1N25390: R10.1 USB1.A5(CC1)
$1N26975: R8.2 R8.3 U5.3(VO)
$1N52138: C9.2 L1.1 U4.6(SW)
$1N52395: R9.2 R11.2 U4.3(FB)
$1N56060: J1.1 R13.2 U9.3
$1N59600: R14.1 R15.1
$1N59649: D7.2(A) J3.1 U9.4
$1N59700: D8.2(A) U9.2

Not connected (* = marked no-connect by the designer): KEY1 1* 3*; KEY2 1* 3*; KEY3 3*; LED1 1(Dout)*; P1 5(RQ)*; U1 4(IO4)* 5(IO5)* 6(IO6)* 7(IO7)* 15(IO3)* 16(IO46)* 17(IO9)* 19(IO11)* 26(IO45)* 34(IO41)* 35(IO42)* 36(RXD0)* 37(TXD0)* 38(IO2)* 39(IO1)*; U5 7(DB0)* 8(DB1)* 9(DB2)* 10(DB3)*; USB1 A8(SBU1)* B8(SBU2)*

## Notes on the sheets
sheet 1
- MACHINE CONTROL
- BUTTONS
- Icoil=120mA
- Lower VDD by 0.6V
  |VDD-VDI|< 1.2V
- Active type, 3V
  Inom<40mA
- CONNECTORS
- USB C
- SOUND
- NEOPIXEL
- BUCK CONVERTER
- 6.0-40V DC
- MODULES INTERCONNECTS
- max 800 mA
- POWER TB
- min 4.3V DC
  max 15V DC
- max 500 mA
- MACHINE TB
- 3V3 LDO
sheet 2
- IDEAS
- CHANGELOG
- - use ENIG gold finish on front panel for graphical element
- - Rev1.3 : diode for reverse powerflow USB protection
  - Rev1.3 : mains AC on PCB change
- - evaluate protection if both USB and external power are active.
- - Implement overvoltage protection on 5V
  - Layout: move switching converter away from the rest. Review layout based on PCB in datasheets.
  - Make the design 230VAC compliant, add earthing connection
- - Rev1.2 : fixed input protection
  - Rev1.2 : soldering pad for 5V/3V3 EXT
- - Rev1.1 : fixed R11 connection between FB and GND
  - Rev1.1 : fixed footprint of RFID chip (pins description in reverse order)
  - Rev1.1 : moved buzzer to top side
  - Rev1.1 : fixed wrong footprint of Q1

# Board COLOR Front panel
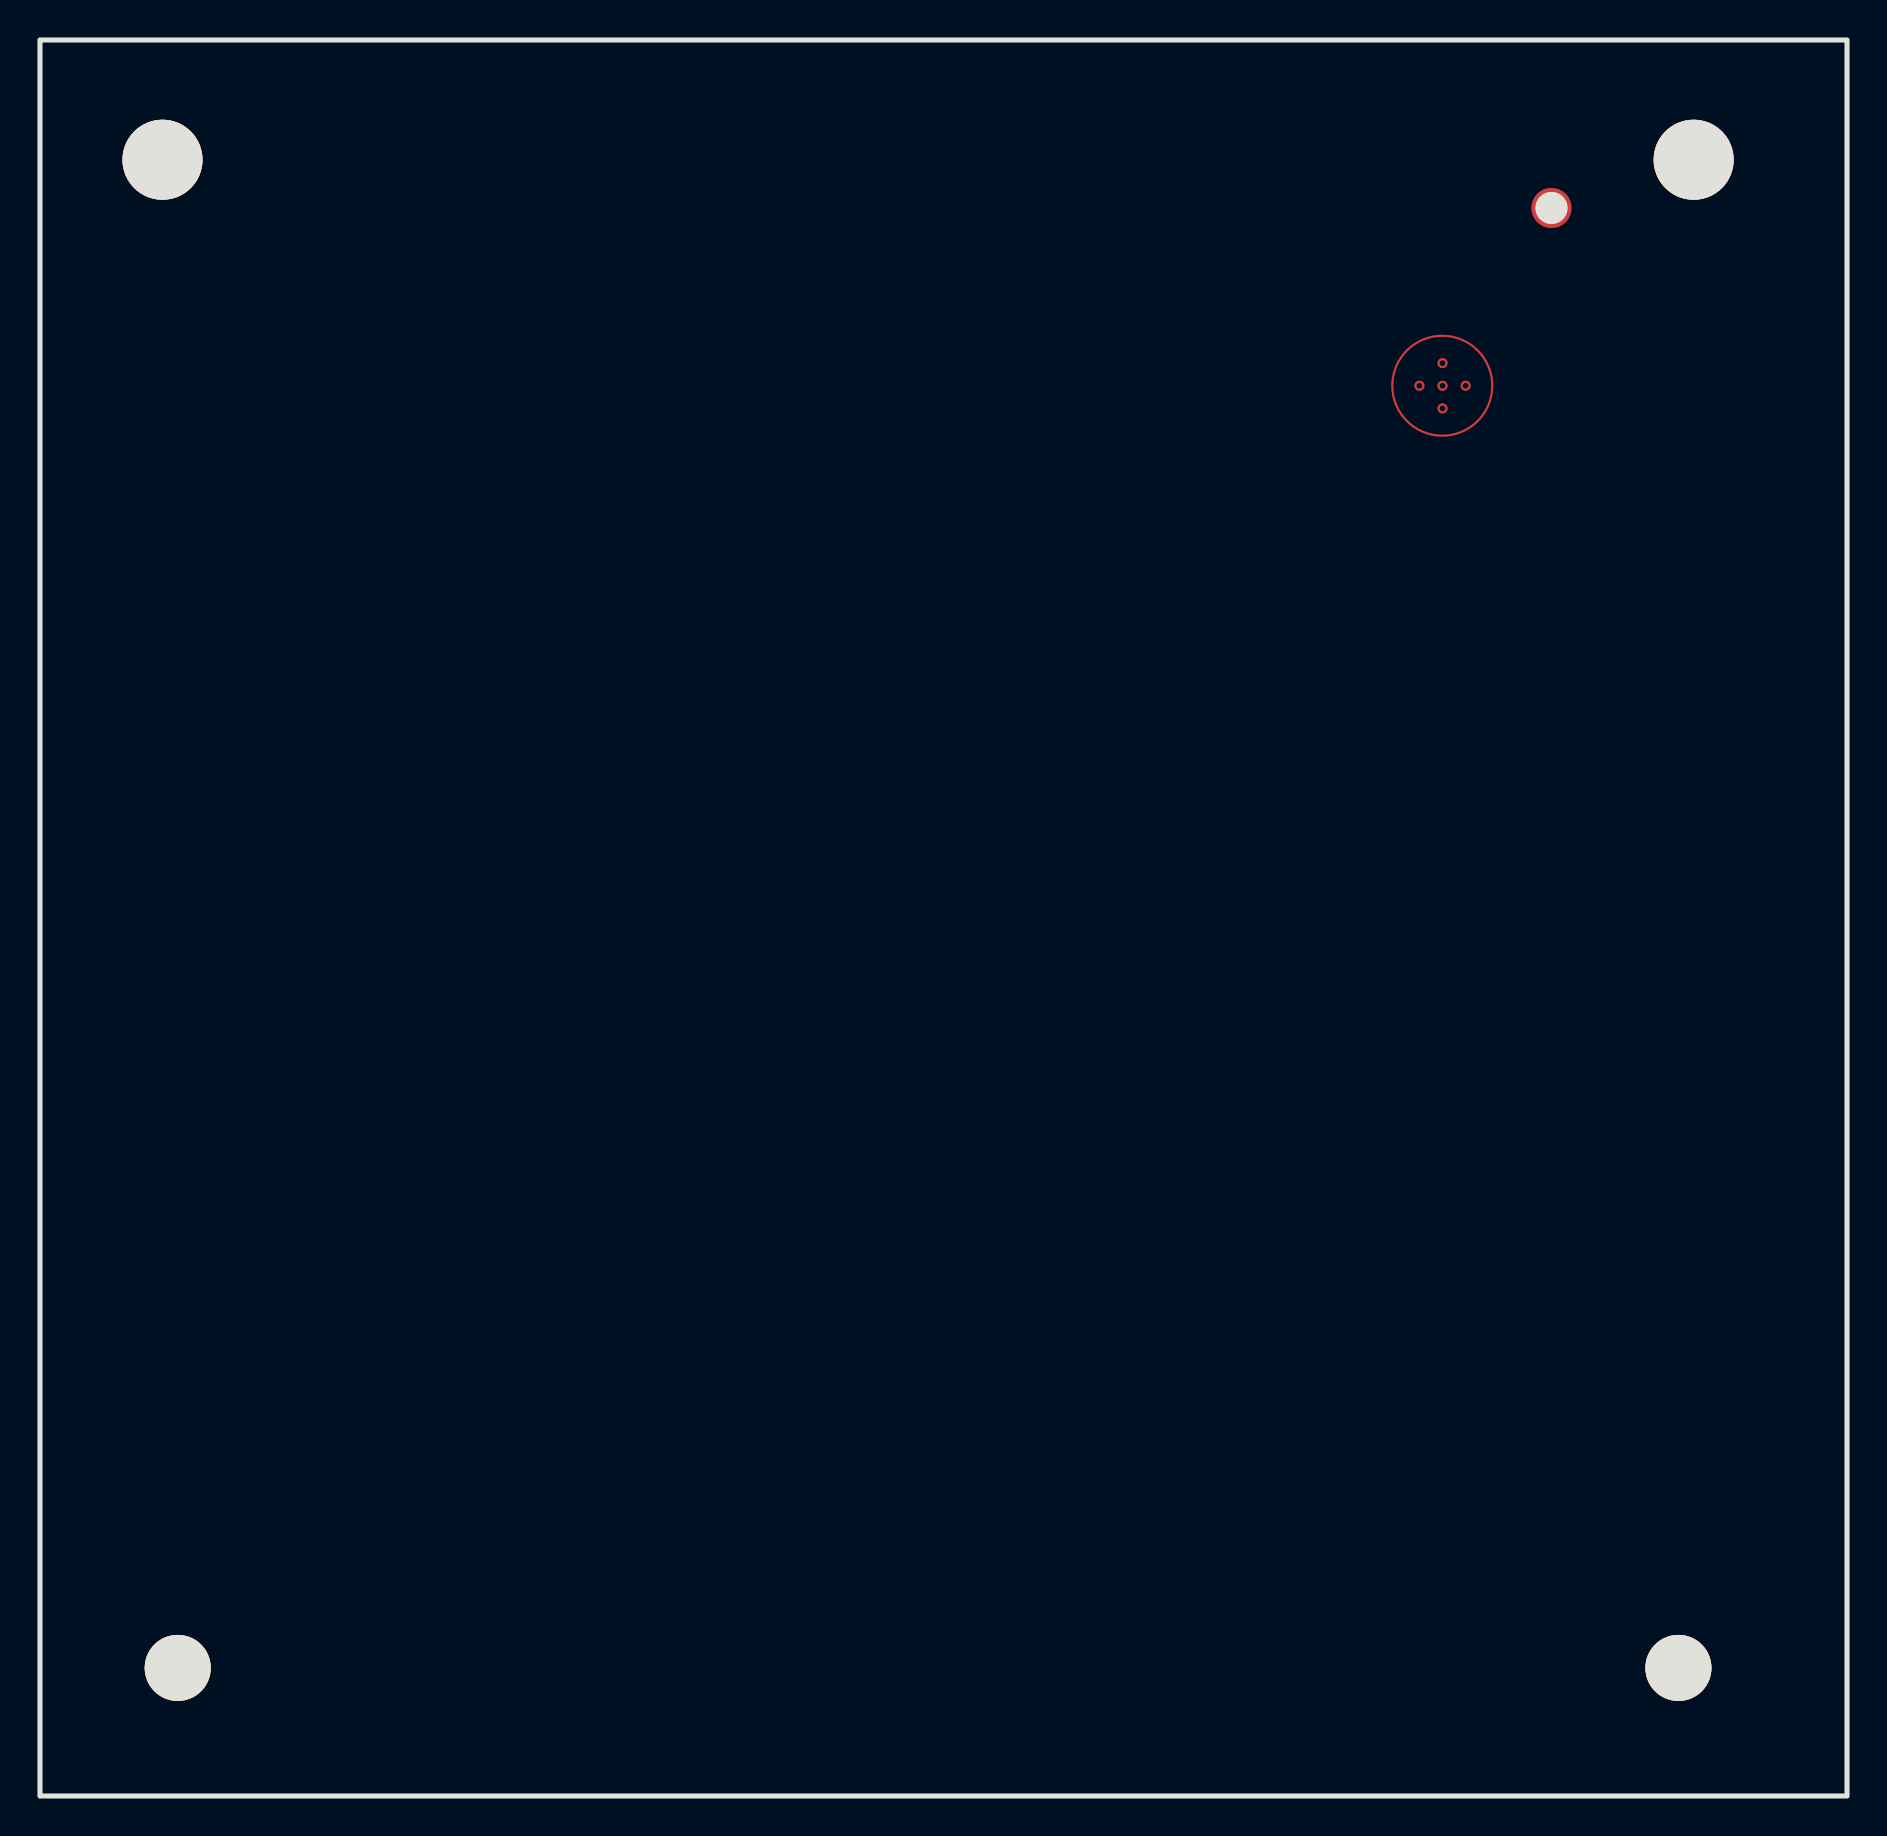
[diagram p2: board, top side]
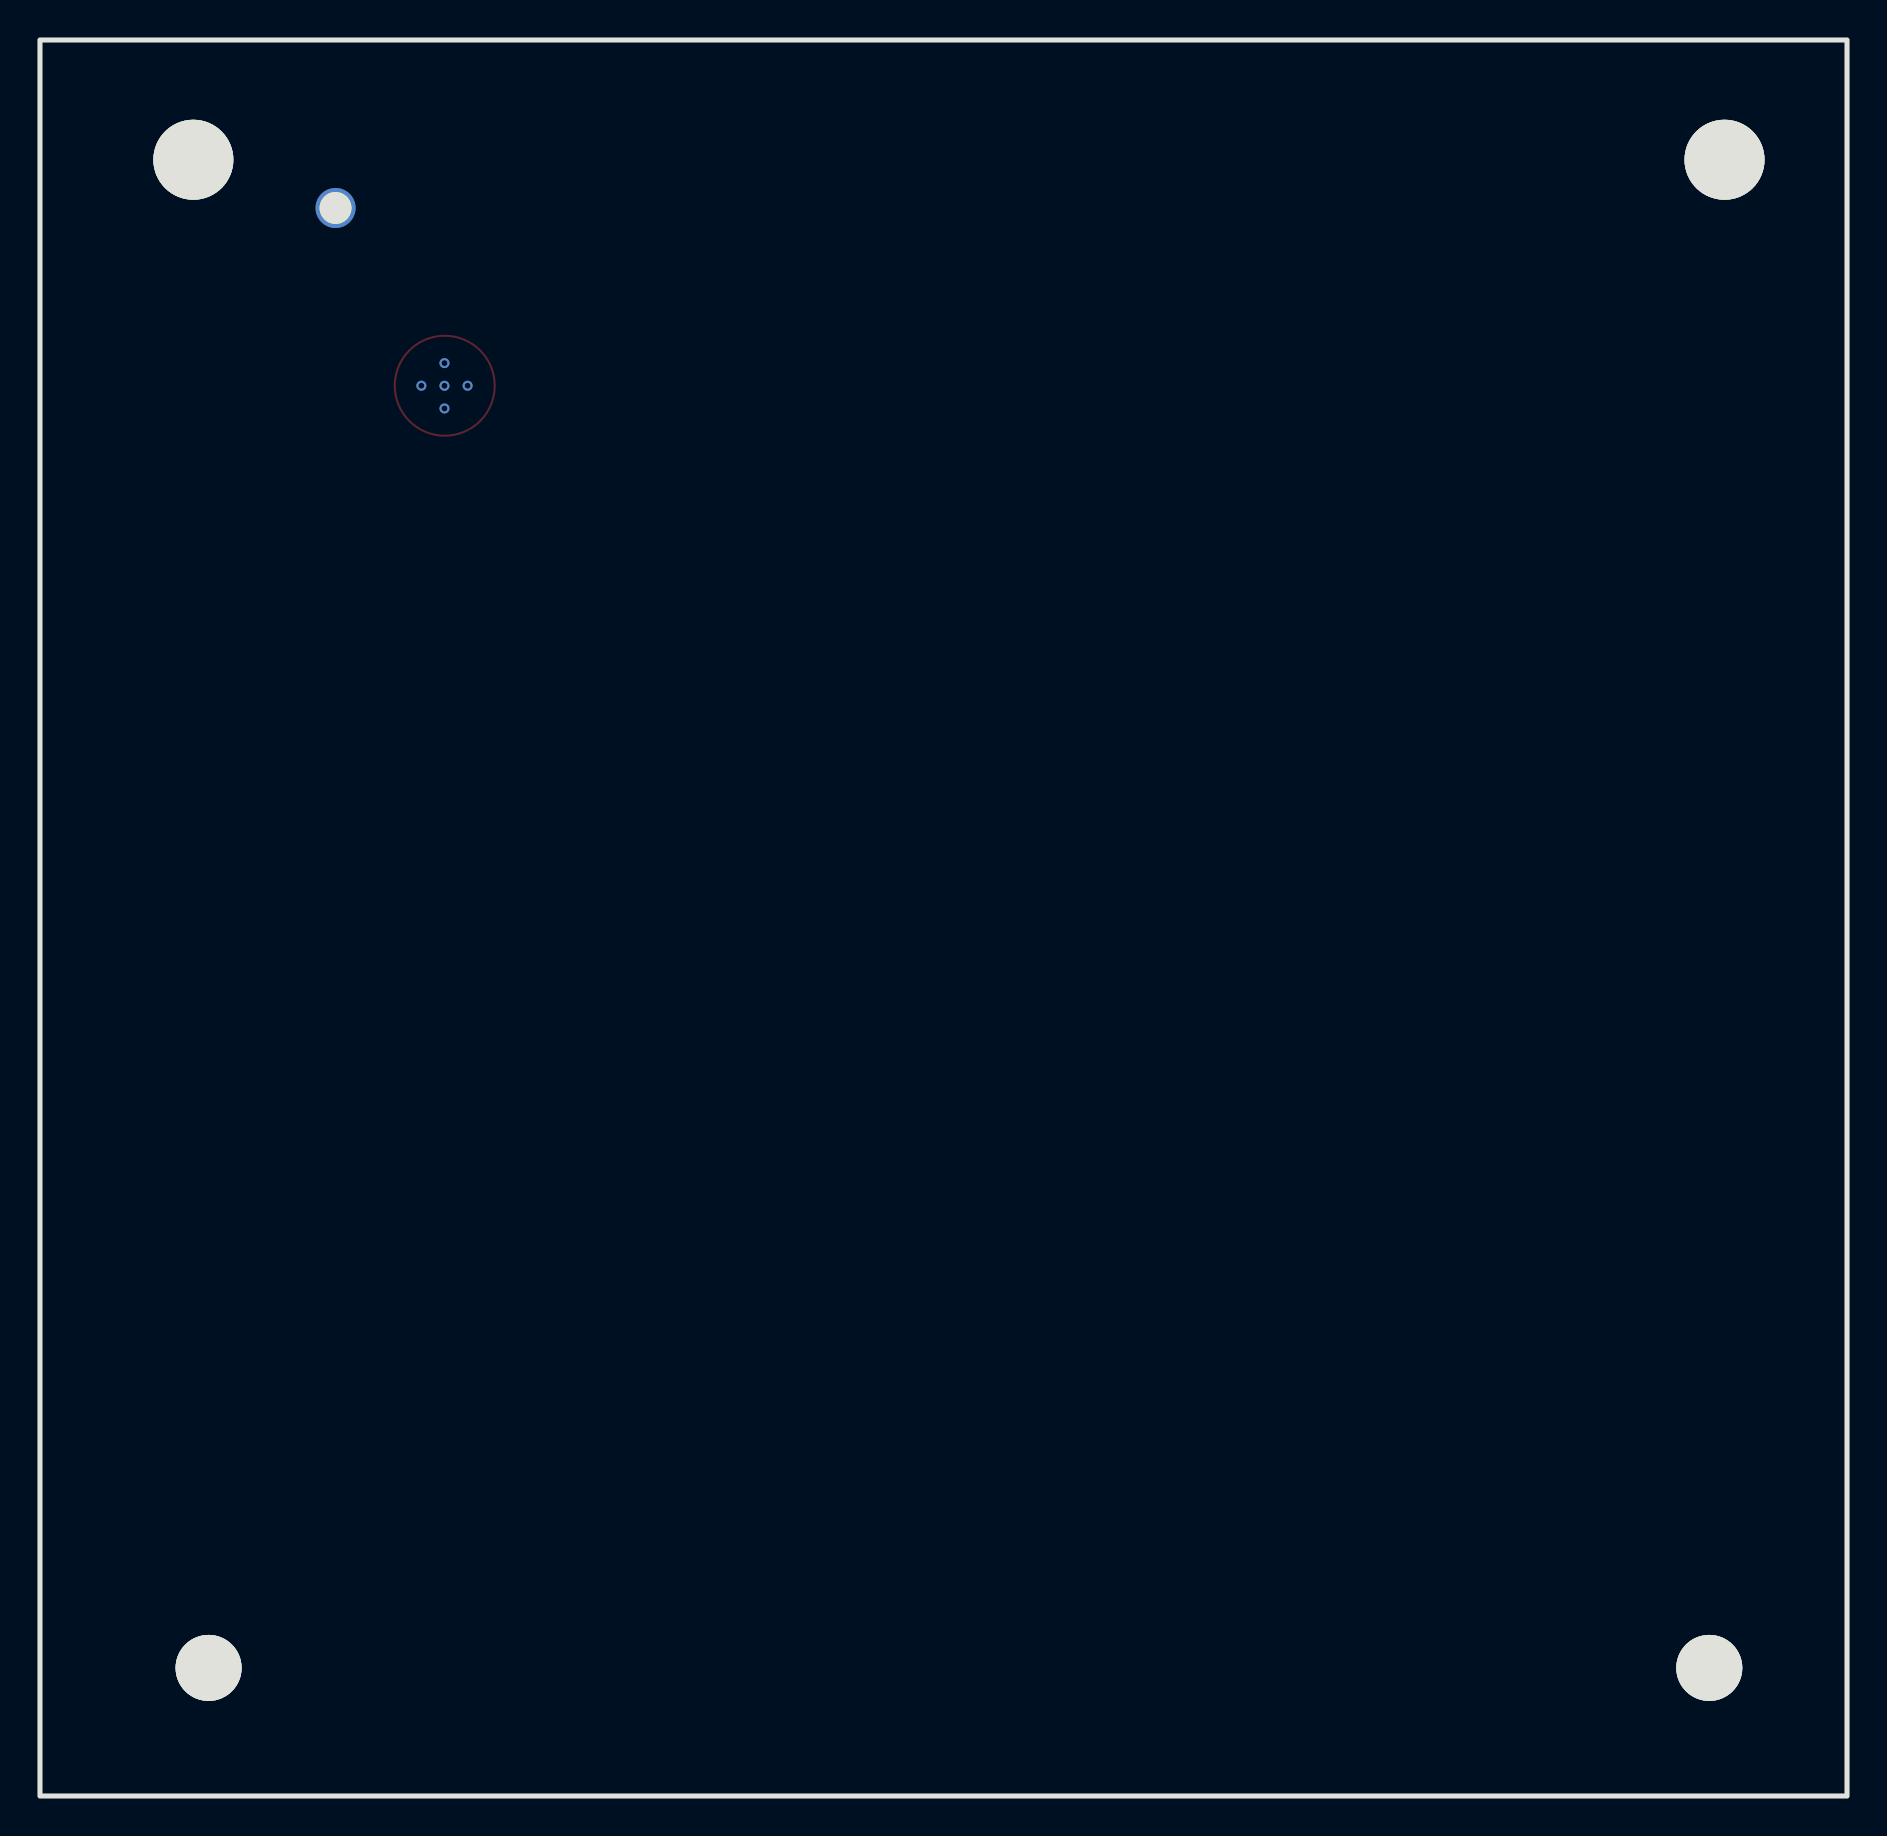
[diagram p3: board, bottom side, seen from below]

Outline 90.38 x 87.84 mm; copper layers: Top Layer, Bottom Layer. Coordinates in mm from the lower left corner of the outline.
Outline path: rectangle 0,87.84 90.38,0
Stack: Top Layer 0.035mm / Dielectric1 1.51mm FR4 er 4.5 / Bottom Layer 0.035mm

## Design rules (mm)
template: JLCPCB Capability(Two Layers Board)
spacing copperThickness1oz (default): track to track 0.102, other pairs 0.152 to 0.3
spacing copperThickness2oz: track to track 0.203, other pairs 0.152 to 0.3
track width copperThickness1oz (default): min 0.127, default 0.254, max 2.54
track width copperThickness2oz: min 0.203, default 0.254, max 2.54
differential pair differentialPair (default): width min 0.127, default 0.254, max 2.54; gap min 0.152, default 0.152
via viaSize (default): diameter min 0.5, default 0.61, max 10; hole min 0.3, default 0.305, max 6.3

## Placement (name value [footprint] x y rotation side)
NOREF  -  [Pad_e74]  75.6 79.43 0 top
NOREF#2  -  [Pad_e114]  82.71 81.85 0 top
NOREF#3  -  [Pad_e117]  6.89 6.41 0 top
NOREF#4  -  [Pad_e115]  6.13 81.85 0 top
NOREF#5  -  [Pad_e116]  81.95 6.41 0 top

## Footprints (pads in the part's own frame, mm; a bottom-side part is the same pattern mirrored in y, then rotated)
Pad_e74
  round 2 hole 1.6: 1(0,0)
Pad_e114
  round 4 hole 4: 1(0,0)
Pad_e115
  round 4 hole 4: 1(0,0)
Pad_e116
  round 3.3 hole 3.3: 1(0,0)
Pad_e117
  round 3.3 hole 3.3: 1(0,0)

## Nets

Pads without a net: NOREF 1; NOREF#2 1; NOREF#3 1; NOREF#4 1; NOREF#5 1

## Via types
v1: diameter 0.5, hole 0.3, Top Layer to Bottom Layer, 5 vias

## Routing (per net, layer and track width the routed paths; a pad name or vN(x,y) marks a point on that pad's centre or on a via; arc(x,y) is an arc through that point)
(no net):
  vias: v1(68.99,70.54) v1(70.15,71.67) v1(70.15,70.54) v1(70.15,69.41) v1(71.3,70.54)

## Text on the board
Document Layer: Changelog: / - 24/04 removed copper area to avoid RFID shielding / - 04/05 removed holes for buzzer and neopixel, added transparent area / - 19/05 enlarged reset hole 1.6mm / - 24/06 added vias for LCD opening

# Board PCB REV1.3
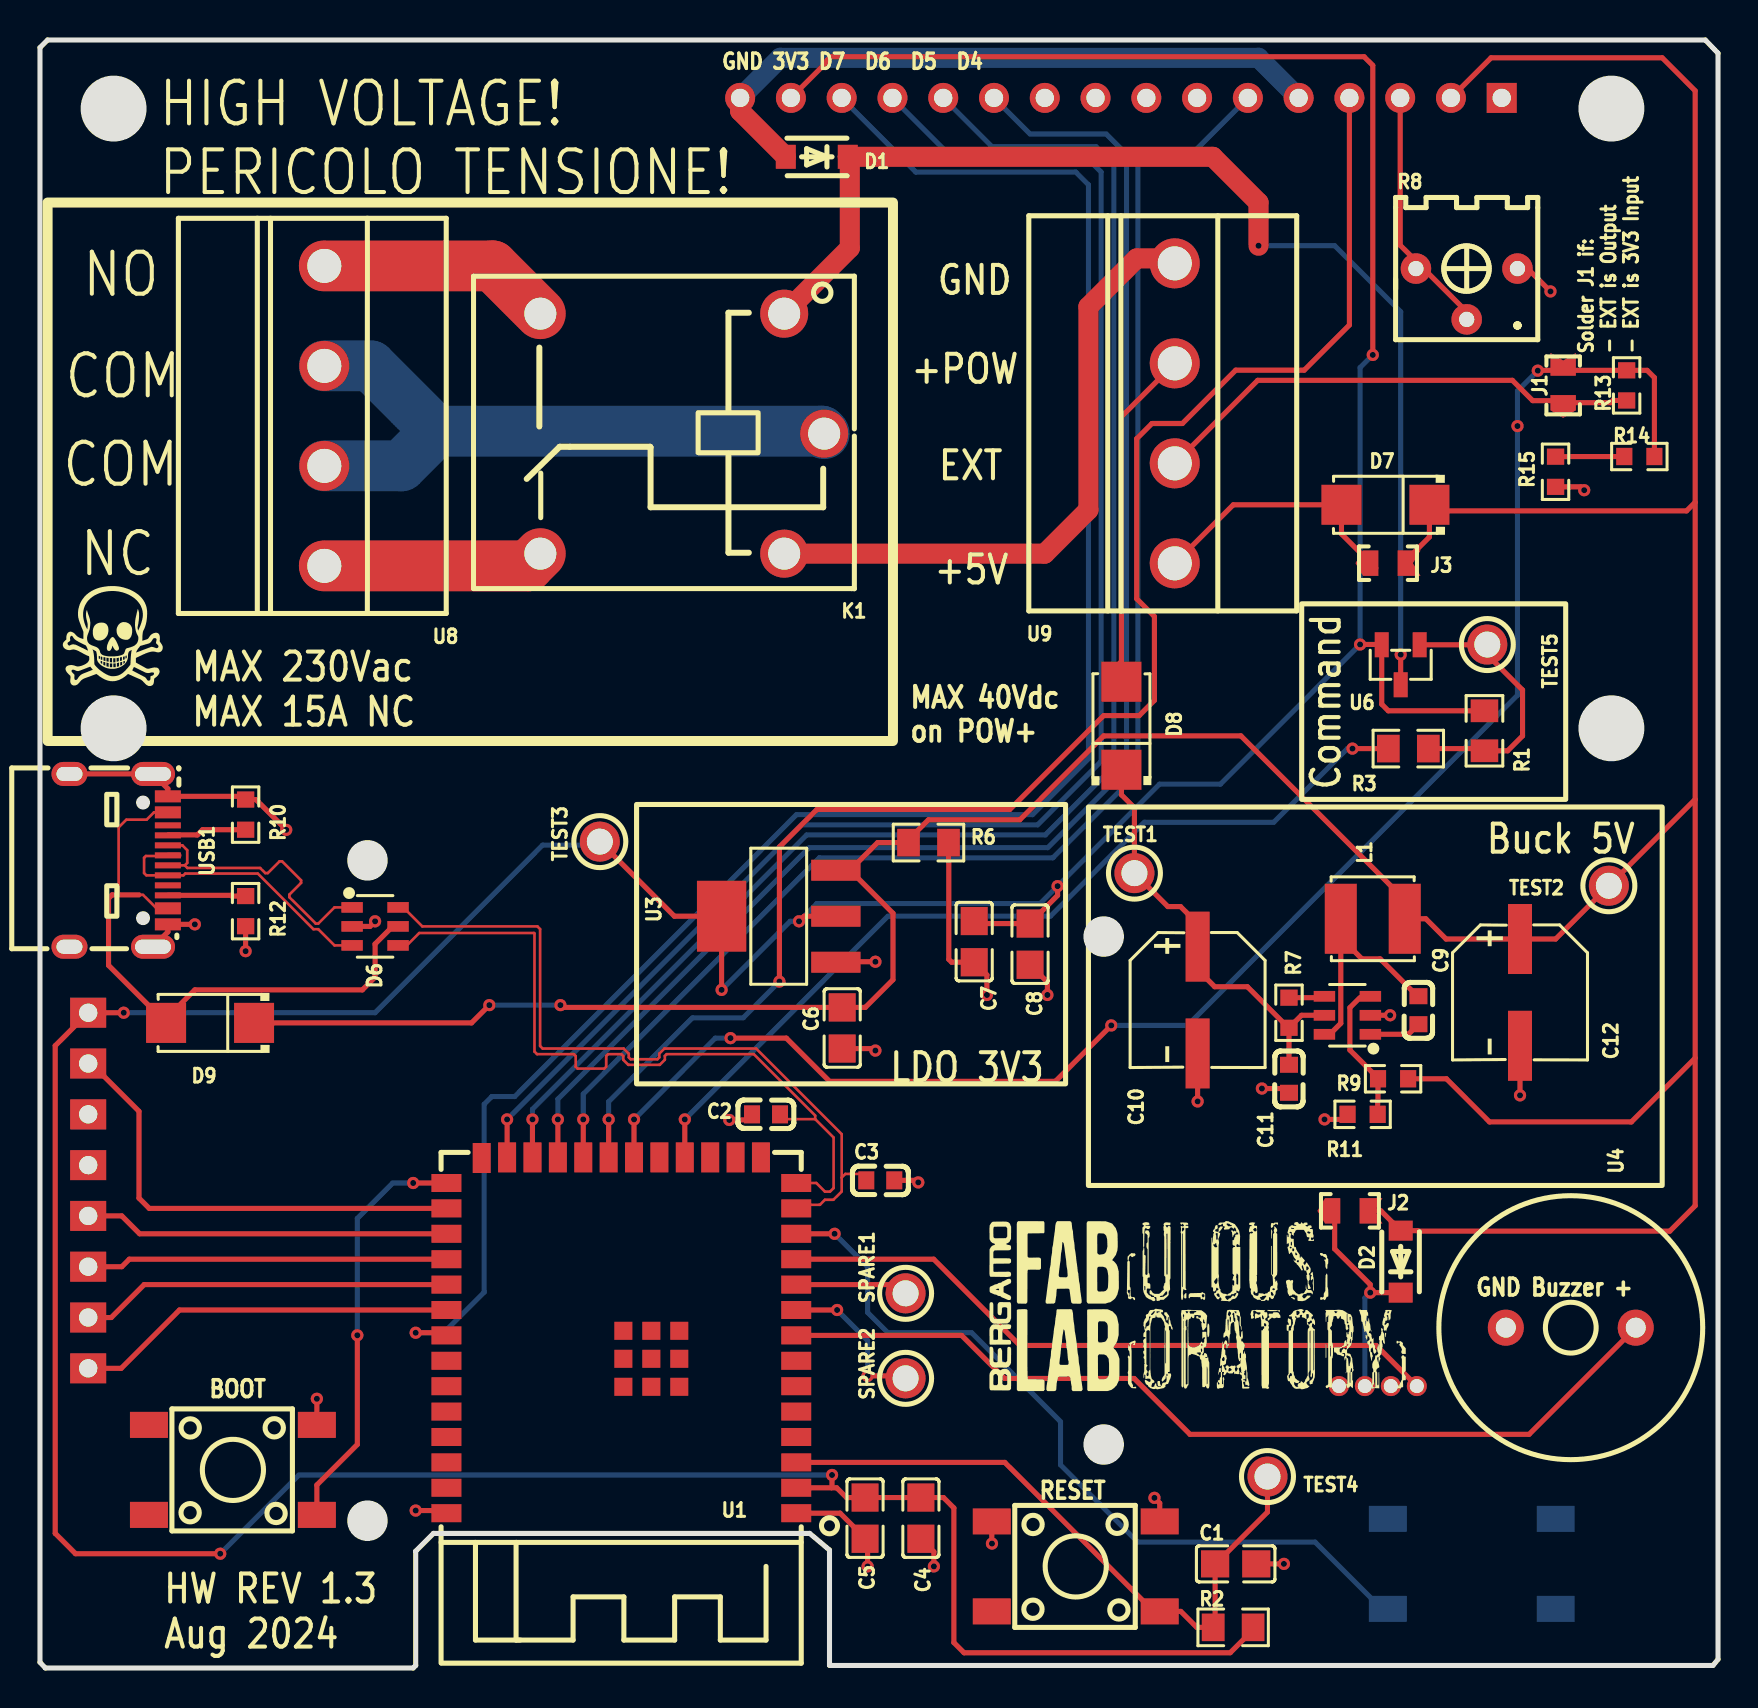
[diagram p4: board, top side]
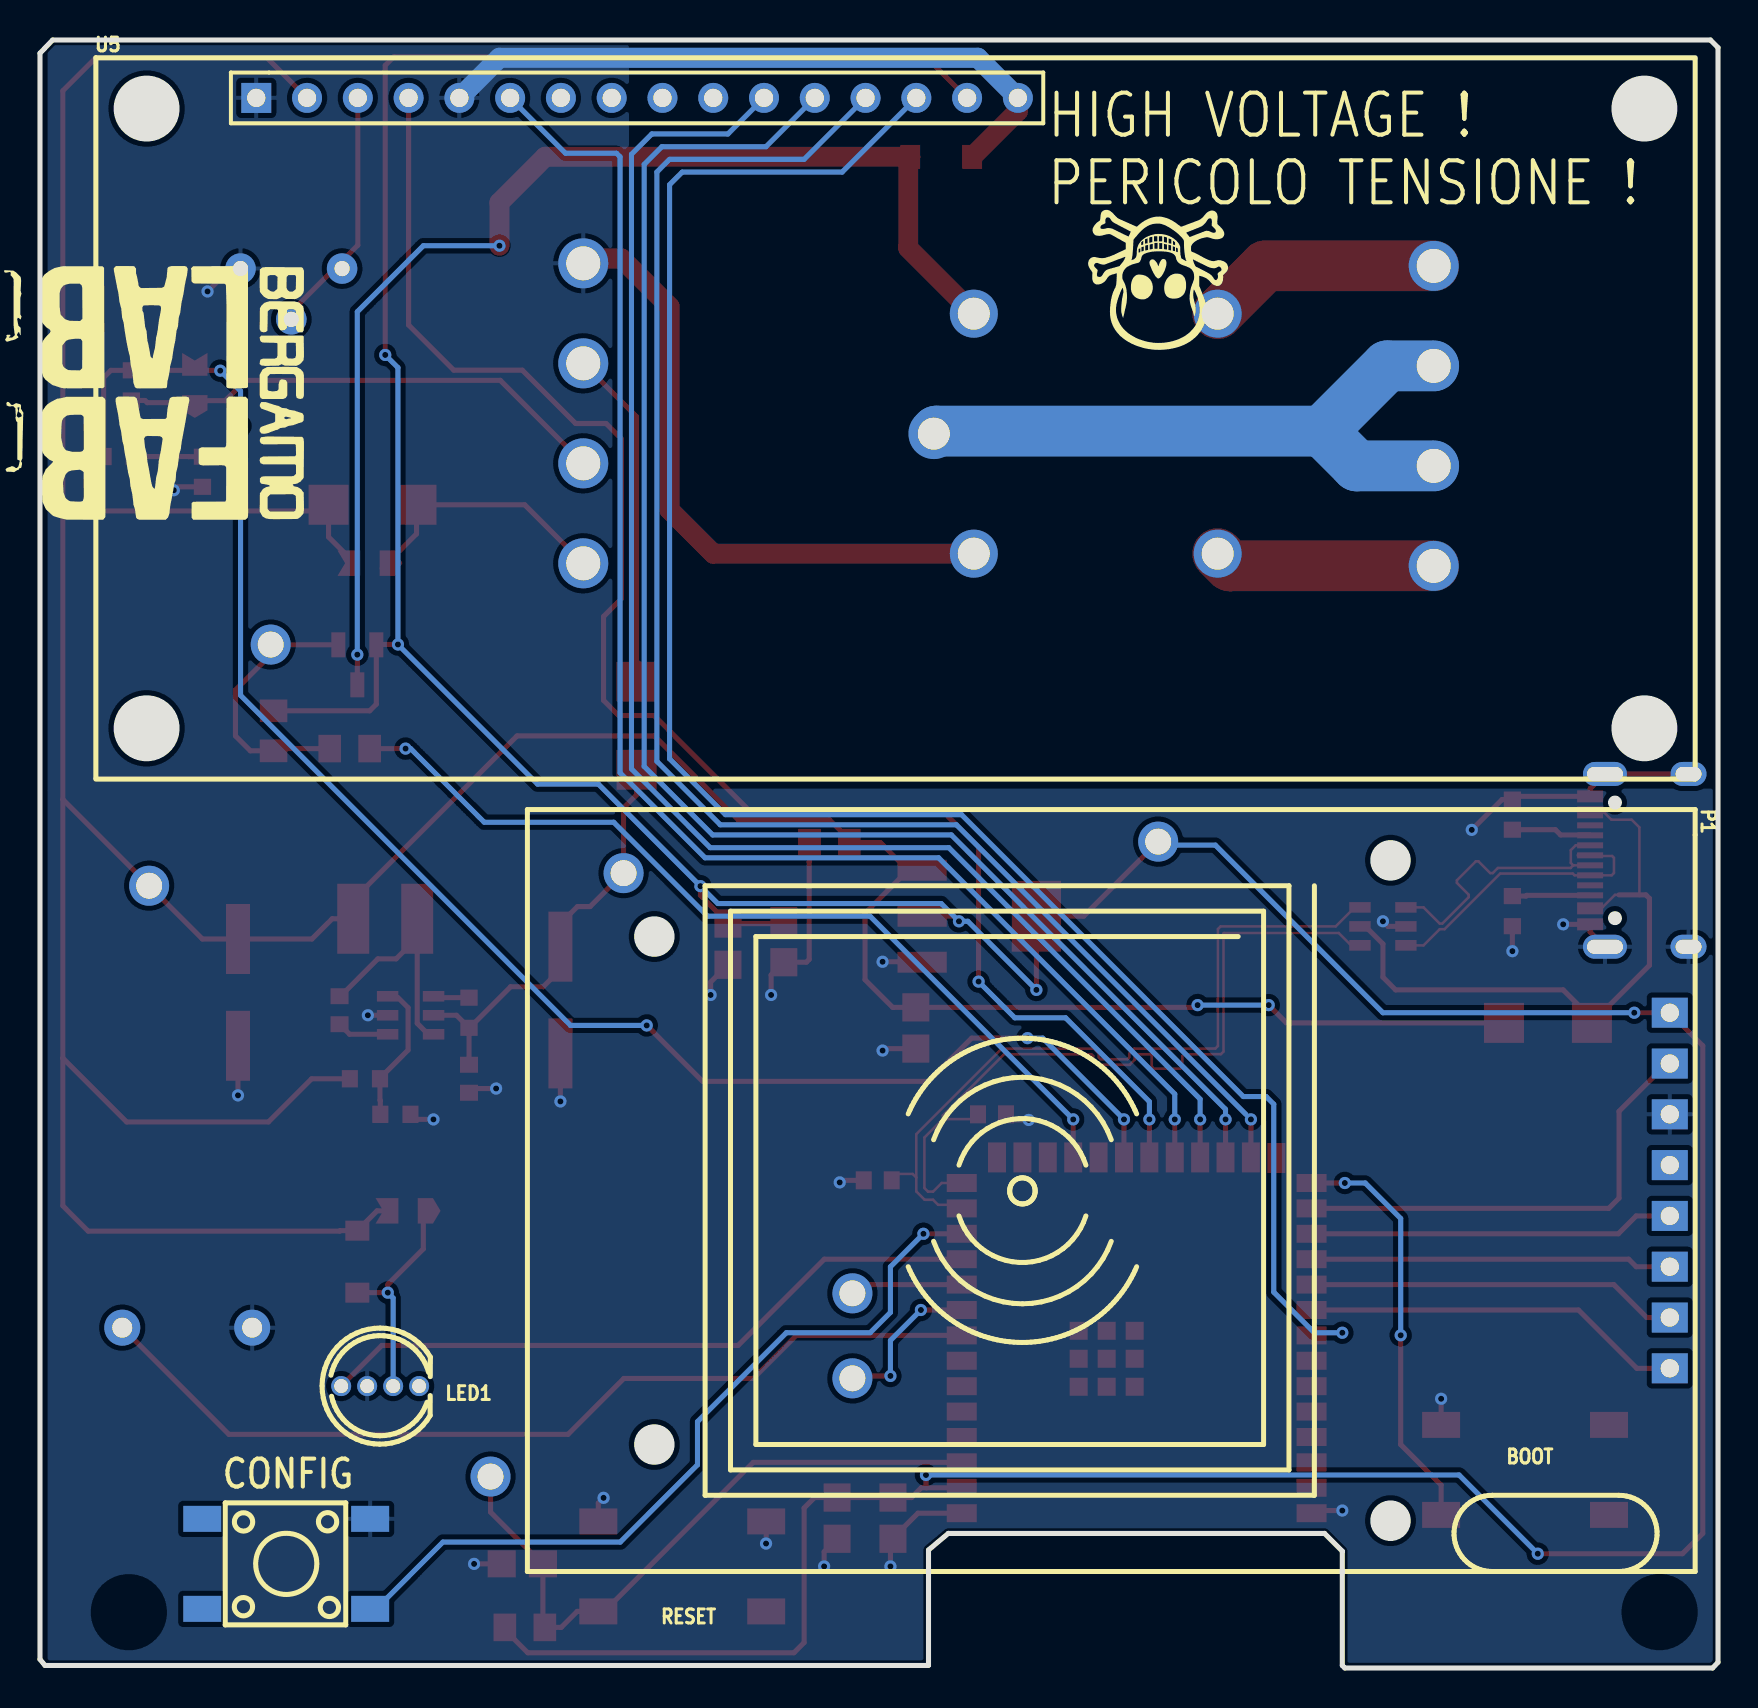
[diagram p5: board, bottom side, seen from below]

Outline 83.95 x 81.41 mm; copper layers: Top Layer, Bottom Layer. Coordinates in mm from the lower left corner of the outline.
Outline path: 0,81.03 0.38,81.41 83.31,81.41 83.95,80.75 83.95,0.43 83.7,0.13 39.62,0.13 39.5,0.13 39.5,5.9 38.51,6.73 19.69,6.73 18.8,5.84 18.8,0.13 18.67,0 0.27,0 0,0.29 0,81.03
Stack: Top Layer 0.035mm / Dielectric1 1.51mm FR4 er 4.5 / Bottom Layer 0.035mm

## Design rules (mm)
net USB-D+: Others, DP2
net USB-D-: Others, DP2
net IO17: Others
net IO16: Others
net GND: Others
net 3V3: Others
net LCD_D7: Others
net LCD_D6: Others
net LCD_D5: Others
net LCD_D4: Others
net LCD_EN: Others
net LCD_RS: Others
net 5V: Others
net MCU_RESET: Others
net BUZ: Others
net NEO: Others
net CMD: Others
net BOOT: Others
net RFID_RST: Others
net RFID_MISO: Others
net RFID_MOSI: Others
net RFID_SCK: Others
net RFID_SDA: Others
net POW+: Others
net OUT_NO: ACMAINS
net OUT_COMMON: ACMAINS
net OUT_NC: ACMAINS
net $1N86: Others
net $1N85: Others
net $1N90: Others
net $1N15737: Others
net $1N15956: Others
net SPARE3: Others
net $1N25390: Others
net $1N24952: Others
net DN: Others, DP3
net DP: Others, DP3
net $1N26975: Others
net $1N52395: Others
net $1N52138: Others
net CONFIG: Others
net $1N56060: Others
net $1N59600: Others
net $1N59700: Others
net $1N59649: Others
net VBUS: Others
template: Custom Config
spacing copperThickness1oz (default): track to track 0.102, other pairs 0.152 to 0.3
spacing copperThickness2oz: track to track 0.203, other pairs 0.152 to 0.3
spacing safeClearance1: track to track 2, other pairs 0.152 to 0.3
track width copperThickness1oz (default): min 0.127, default 0.254, max 2.54
track width copperThickness2oz: min 0.203, default 0.254, max 2.54
track width acMains: min 0.5, default 1, max 2.54
differential pair differentialPair (default): width min 0.127, default 0.254, max 2.54; gap min 0.152, default 0.152
via viaSize (default): diameter min 0.5, default 0.61, max 10; hole min 0.3, default 0.305, max 6.3
net class ACMAINS uses acMains, safeClearance1
net OUT_NO uses acMains, safeClearance1
net OUT_COMMON uses acMains, safeClearance1
net OUT_NC uses acMains, safeClearance1

## Placement (name value [footprint] x y rotation side)
BUZZER1  4kHz  [BUZ-TH_BD12.5-P6.50-D0.9]  76.58 17.02 180 top
C1  1uF  [C0805]  59.82 5.21 180 top
C2  22pF  [C0603]  36.32 27.69 0 top
C3  22pF  [C0603]  42.04 24.38 180 top
C4  10uF  [C0805]  44.07 7.49 90 top
C5  100nF  [C0805]  41.27 7.49 90 top
C6  1uF  [C0805]  40.13 32 270 top
C7  10uF  [C0805]  46.74 36.32 90 top
C8  100nF  [C0805]  49.53 36.19 90 top
C9  100nF  [C0603]  68.96 32.89 90 top
C10  22uF  [CAP-SMD_BD6.3-L6.6-W6.6-FD]  57.91 33.4 270 top
C11  100nF  [C0603]  62.48 29.46 90 top
C12  22uF  [CAP-SMD_BD6.3-L6.6-W6.6-FD]  74.04 33.78 270 top
D1  SM4007PL  [SOD-123F_L2.8-W1.8-LS3.7-RD]  38.86 75.56 180 top
D2  SM4007PL  [SOD-123F_L2.8-W1.8-LS3.7-RD]  68.07 20.32 90 top
D6  USBLC6-2SC6  [SOT-23-6_L2.9-W1.6-P0.95-LS2.8-BL]  16.76 37.08 270 top
D7  SS34  [SMA_L4.3-W2.6-LS5.2-RD]  67.31 58.17 180 top
D8  SS34  [SMA_L4.3-W2.6-LS5.2-RD]  54.1 47.12 90 top
D9  SS34  [SMA_L4.3-W2.6-LS5.2-RD]  8.51 32.26 180 top
J1  Jumper  [JUMPER]  76.2 65.4 90 top
J2  Jumper  [JUMPER]  66.8 22.86 0 top
J3  Jumper  [JUMPER]  68.71 55.24 0 top
K1  SRD-03VDC-SL-C  [RELAY-TH_SRD-03VDC-SL-C]  32.13 61.72 180 top
KEY1  TSA063G60-250  [KEY-SMD_4P-L6.1-W6.1-P4.50-LS9.0]  71.63 5.21 180 bottom
KEY2  TSA063G60-250  [KEY-SMD_4P-L6.1-W6.1-P4.50-LS9.0]  9.65 9.91 0 top
KEY3  TSA063G60-250  [KEY-SMD_4P-L6.1-W6.1-P4.50-LS9.0]  51.82 5.08 0 top
L1  10uH  [IND-SMD_L4.0-W4.0]  66.67 37.46 0 top
LED1  WS2812D-F5  [LED-TH_4P-BD5.8-P1.30]  66.93 14.1 180 bottom
P1  RFID  [footprint_17af]  16.26 30.35 270 bottom
R1  10kΩ  [R0805]  72.26 46.86 90 top
R2  10kΩ  [R0805]  59.69 2.03 0 top
R3  560Ω  [R0805]  68.45 45.97 180 top
R6  100kΩ  [R0805]  44.45 41.27 180 top
R7  100kΩ  [R0603]  62.48 32.77 90 top
R8  10kΩ  [RES-ADJ-TH_3362P]  71.37 68.71 180 top
R9  127kΩ  [R0603]  67.69 29.46 180 top
R10  5.1kΩ  [R0603]  10.29 42.67 90 top
R11  24kΩ  [R0603]  66.17 27.69 0 top
R12  5.1kΩ  [R0603]  10.29 37.85 90 top
R13  100kΩ  [R0603]  79.38 64.13 270 top
R14  100kΩ  [R0603]  80.01 60.58 0 top
R15  100kΩ  [R0603]  75.82 59.82 270 top
SPARE1  0577-0-43-80-21-27-10-0  [footprint_662d]  43.3 18.73 0 top
SPARE2  0577-0-43-80-21-27-10-0  [footprint_662d]  43.3 14.48 0 top
TEST1  0577-0-43-80-21-27-10-0  [footprint_662d]  54.75 39.75 0 top
TEST2  0577-0-43-80-21-27-10-0  [footprint_662d]  78.49 39.12 0 top
TEST3  0577-0-43-80-21-27-10-0  [footprint_662d]  28.01 41.32 0 top
TEST4  0577-0-43-80-21-27-10-0  [footprint_662d]  61.41 9.57 0 top
TEST5  0577-0-43-80-21-27-10-0  [footprint_662d]  72.41 51.18 0 top
U1  ESP32-S3-WROOM-1-N4R8  [wirelm-smd_esp32-s3-wroom-1]  29.08 16.64 180 top
U3  LD1117S33TR  [SOT-223_L6.5-W3.5-P2.30-LS7.0-BR]  36.96 37.59 0 top
U4  TP6841S6-A  [SOT-23-6_L2.9-W1.6-P0.95-LS2.8-BL]  65.41 32.64 90 top
U5  LCD-1602  [footprint_8a57]  50.67 64.52 180 bottom
U6  MMBT3906  [SOT-23-3_L2.9-W1.3-P1.90-LS2.4-BR]  68.07 50.16 90 top
U8  DB103-5.0-4P-GN-S  [CONN-TH_4P-P5.00_DB103-5.0-4P-GN-S]  14.22 62.61 270 top
U9  DB103-5.0-4P-GN-S  [CONN-TH_4P-P5.00_DB103-5.0-4P-GN-S]  56.77 62.74 270 top
USB1  U262-161N-4BVC11  [USB-3.1-SMD_U262-161N-4BVC11]  3.94 40.39 270 top

## Footprints (pads in the part's own frame, mm; a bottom-side part is the same pattern mirrored in y, then rotated)
BUZ-TH_BD12.5-P6.50-D0.9
  round 1.8 hole 1: 1(-3.25,0) 2(3.25,0)
C0603
  rect 0.8x0.9 smd: 1(-0.7,0) 2(0.7,0)
C0805
  rect 1.41x1.35 smd: 1(-1.03,0) 2(1.03,0)
CAP-SMD_BD6.3-L6.6-W6.6-FD
  rect 3.5x1.2 smd: 1(-2.67,0) 2(2.67,0)
CONN-TH_4P-P5.00_DB103-5.0-4P-GN-S
  round 2.5 hole 1.7: 1(-7.5,0) 2(-2.5,0) 3(2.5,0) 4(7.5,0)
footprint_8a57
  rect 1.498x1.498 hole 0.914: 1(-22.453,13.995)
  round 1.498 hole 0.914: 2(-19.913,13.995) 3(-17.373,13.995) 4(-14.834,13.995) 5(-12.293,13.995) 6(-9.754,13.995) 7(-7.213,13.995) 8(-4.673,13.995) 9(-2.134,13.995) 10(0.406,13.995) 11(2.946,13.995) 12(5.487,13.995) 13(8.027,13.995) 14(10.566,13.995) 15(13.107,13.995) 16(15.646,13.995)
footprint_17af
  rect 1.5x1.8 hole 0.914: 1(15.367,13.844) 2(12.827,13.844) 3(10.287,13.844) 4(7.747,13.844) 5(5.207,13.844) 6(2.667,13.844) 7(0.127,13.844) 8(-2.413,13.844)
footprint_662d
  round 2 hole 1.3: 1(0,0)
IND-SMD_L4.0-W4.0
  rect 1.6x3.5 smd: 1(-1.6,0) 2(1.6,0)
JUMPER
  custom 1.143x1.27 smd: 1(-2.134,0) 2(-0.406,0)
KEY-SMD_4P-L6.1-W6.1-P4.50-LS9.0
  rect 1.9x1.3 smd: 1(-4.2,2.25) 2(4.2,2.25) 3(-4.2,-2.25) 4(4.2,-2.25)
LED-TH_4P-BD5.8-P1.30
  round 1 hole 0.7: 1(1.95,0) 2(0.65,0) 3(-0.65,0) 4(-1.95,0)
R0603
  rect 0.806x0.864 smd: 1(-0.753,0) 2(0.753,0)
R0805
  rect 1.133x1.377 smd: 1(-1,0) 2(1,0)
RELAY-TH_SRD-03VDC-SL-C
  round 2.4 hole 1.6: 1(-5.1,-6) 2(7.1,-6) 3(7.1,6) 4(-5.1,6) 5(-7.1,0)
RES-ADJ-TH_3362P
  round 1.524 hole 0.762: 1(-2.54,-1.27) 2(0,1.27) 3(2.54,-1.27)
SMA_L4.3-W2.6-LS5.2-RD
  rect 2x2 smd: 1(-2.2,0) 2(2.2,0)
SOD-123F_L2.8-W1.8-LS3.7-RD
  rect 1x1.2 smd: 1(-1.55,0) 2(1.55,0)
SOT-23-3_L2.9-W1.3-P1.90-LS2.4-BR
  rect 1.25x0.7 smd: 1(1,-0.95) 2(1,0.95) 3(-1,0)
SOT-23-6_L2.9-W1.6-P0.95-LS2.8-BL
  rect 0.532x1.072 smd: 1(-0.95,-1.149) 2(0,-1.149) 3(0.95,-1.149) 4(0.95,1.149) 5(0,1.149) 6(-0.95,1.149)
SOT-223_L6.5-W3.5-P2.30-LS7.0-BR
  rect 2.465x1.05 smd: 1(2.857,-2.3) 2(2.857,0) 3(2.857,2.3)
  rect 2.465x3.54 smd: 4(-2.857,0)
USB-3.1-SMD_U262-161N-4BVC11
  rect 0.6x1.3 smd: A1B12(-3.2,2.462) A4B9(-2.4,2.462) B1A12(3.2,2.462) B4A9(2.4,2.462)
  rect 0.3x1.3 smd: A5(-1.25,2.462) A6(-0.25,2.462) A7(0.25,2.462) A8(1.25,2.462) B5(1.75,2.462) B6(0.75,2.462) B7(-0.75,2.462) B8(-1.75,2.462)
  oval 1.2x2.2 hole 0.7x1.8: SHELL(-4.32,1.719) SHELL(4.32,1.719)
  oval 1.2x1.8 hole 0.7x1.3: SHELL(-4.32,-2.462) SHELL(4.32,-2.462)
wirelm-smd_esp32-s3-wroom-1
  rect 1.5x0.9 smd: 1(-8.75,8.895) 2(-8.75,7.625) 3(-8.75,6.355) 4(-8.75,5.085) 5(-8.75,3.815) 6(-8.75,2.545) 7(-8.75,1.275) 8(-8.75,0.005) 9(-8.75,-1.265) 10(-8.75,-2.535) 11(-8.75,-3.805) 12(-8.75,-5.075) 13(-8.75,-6.345) 14(-8.75,-7.615) 27(8.75,-7.615) 28(8.75,-6.345) 29(8.75,-5.075) 30(8.75,-3.805) 31(8.75,-2.535) 32(8.75,-1.265) 33(8.75,0.005) 34(8.75,1.275) 35(8.75,2.545) 36(8.75,3.815) 37(8.75,5.085) 38(8.75,6.355) 39(8.75,7.625) 40(8.75,8.895)
  rect 0.9x1.5 smd: 15(-6.985,-8.895) 16(-5.715,-8.895) 17(-4.445,-8.895) 18(-3.175,-8.895) 19(-1.905,-8.895) 20(-0.635,-8.895) 21(0.635,-8.895) 22(1.905,-8.895) 23(3.175,-8.895) 24(4.445,-8.895) 25(5.715,-8.895) 26(6.985,-8.865)
  rect 0.9x0.9 smd: 41(-2.9,2.575) 41(-2.9,1.175) 41(-2.9,-0.225) 41(-1.5,2.575) 41(-1.5,1.175) 41(-1.5,-0.225) 41(-0.1,2.575) 41(-0.1,1.175) 41(-0.1,-0.225)

## Nets
As in the schematic.

Pads without a net: KEY1 1 3; KEY2 1 3; KEY3 3; LED1 1; P1 5; U1 4 5 6 7 15 16 17 19 26 34 35 36 37 38 39; U5 7 8 9 10; USB1 A8 B8

## Via types
v1: diameter 0.61, hole 0.305, Top Layer to Bottom Layer, 56 vias

## Routing (per net, layer and track width the routed paths; a pad name or vN(x,y) marks a point on that pad's centre or on a via; arc(x,y) is an arc through that point)
3V3: length 254.6
  Top Layer w0.254: v1(39.62,9.65) 39.62,9.04 39.6,9.01 ; U3.2 38.23,37.59 v1(37.97,37.34) ; TEST3.1 31.74,37.59 U3.4 v1(34.1,33.91) ; U5.15 39.37,80.31 39.37,80.39 39.55,80.57 66.24,80.57 66.67,80.14 v1(66.67,65.66) ; R2.2 60.69,1.91 59.54,0.76 46.23,0.76 45.72,1.27 45.72,8 45.2,8.52 C4.2 C5.2 40.35,8.52 39.86,9.01 39.6,9.01 ; 0.76,31.11 0.76,6.73 1.78,5.72 v1(9.02,5.72) ; v1(50.91,39.1) 50.91,38.63 49.53,37.25 C8.2 46.86,37.22 C7.2 ; v1(66.04,51.18) 67.11,51.18 U6.2 67.12,48.19 67.45,47.86 R1.2 ; 39.6,9.01 U1.2 ; 0.76,31.12 P1.8 v1(4.19,32.77)
  Bottom Layer w0.254: v1(66.67,65.66) 66.04,65.02 v1(66.04,51.18) 59.05,44.2 56.01,44.2 v1(50.91,39.1) 50.04,38.23 38.86,38.23 v1(37.97,37.34) 37.53,37.34 v1(34.1,33.91) ; TEST3.1 27.83,41.15 25.15,41.15 16.76,32.77 v1(4.19,32.77) ; v1(9.02,5.72) 12.95,9.65 v1(39.62,9.65)
5V: length 213.5
  Top Layer w0.254: v1(26.04,33.15) 26.15,33.03 C6.1 41.29,33.03 42.67,34.42 42.67,37.74 40.52,39.89 ; 82.8,58.29 82.37,57.86 69.56,57.86 69.51,57.91 ; 82.8,58.29 82.8,43.43 ; 82.8,58.29 82.8,78.87 81.15,80.52 72.59,80.52 U5.2 ; 82.8,43.43 82.8,30.5 ; 82.8,43.43 TEST2.1 75.82,36.45 C12.1 70.34,36.45 69.33,37.46 L1.2 68.27,38.41 60.08,46.61 53.21,46.61 49.02,42.42 44.45,42.42 43.45,41.42 R6.2 41.91,41.27 40.52,39.89 ; 82.8,30.5 82.8,23.11 81.53,21.84 68.95,21.84 68.93,21.87 D2.2 67.08,22.86 J2.2 ; 82.8,30.5 79.61,27.3 72.52,27.3 70.36,29.46 R9.1 ; 40.52,39.89 U3.3 ; 69.51,57.91 69.38,58.04 ; 69.51,57.91 69.51,56.56 68.55,55.6 68.55,54.99 ; 69.51,57.91 D7.1 ; D9.1 21.59,32.26 v1(22.48,33.15)
  Bottom Layer w0.254: v1(22.48,33.15) v1(26.04,33.15)
GND: length 126.3
  Top Layer w0.254: KEY3.2 56.02,8.25 v1(55.75,8.51) ; USB1.SHELL 6.4,36.81 USB1.B1A12 v1(7.75,37.19) ; v1(41.4,5.08) 41.4,6.34 C5.1 41.27,6.49 40.03,7.74 U1.1 ; KEY2.2 v1(13.85,13.46) ; 35.75,27.43 35.72,27.4 v1(34.48,27.4) ; C11.1 62.27,28.98 v1(61.13,28.98) ; C8.1 50.4,34.3 v1(50.4,33.65) ; D6.2 16.51,37.08 v1(16.76,37.34) ; v1(41.79,35.32) 39.84,35.32 U3.1 ; v1(10.29,35.84) R12.1 ; v1(47.63,6.22) 47.63,6.42 47.62,6.43 KEY3.1 ; 42.74,24.38 43.84,24.38 v1(43.94,24.28) ; C6.2 41.69,30.97 v1(41.79,30.87) ; v1(12.32,41.91) 10.8,43.43 R10.2 10.13,43.59 USB1.A1B12 6.4,43.96 USB1.SHELL USB1.SHELL ; v1(57.91,28.33) C10.2 ; U1.40 20.2,7.87 v1(18.8,7.87) ; C4.1 44.72,5.81 v1(44.72,5.08) ; v1(47.37,33.65) 47.37,34.66 C7.1 45.61,35.29 45.47,35.43 45.47,40.32 45.45,40.33 R6.1 ; R8.1 74.3,70.36 74.3,70.1 v1(75.57,68.83) ; v1(64.26,27.43) 65.16,27.43 R11.1 ; U4.2 v1(67.54,32.64) ; v1(74.04,28.64) C12.2 ; R15.2 77.08,59.06 v1(77.25,58.89) ; C1.1 v1(62.23,5.21)
  Top Layer w1: D1.2 35.03,77.85 U5.16 ; U9.1 56.52,70.48 54.86,70.48 52.45,68.07 52.45,57.91 50.26,55.72 K1.4
  Bottom Layer w1: U5.16 37.03,80.52 60.96,80.52 U5.5
VBUS: length 31.6
  Top Layer w0.128: 3.94,38.66 3.94,42.04 4.32,42.42 5.33,42.42 5.7,42.79 USB1.A4B9 ; 4.95,38.66 5.15,38.66 5.83,37.99 USB1.B4A9
  Top Layer w0.254: 4.95,38.66 3.61,38.66 3.43,38.48 3.43,35.14 6.31,32.26 6.31,32.47 7.75,33.91 16.13,33.91 16.76,34.54 16.76,36.2 17.64,37.08 D6.5
BOOT: length 20.9
  Top Layer w0.254: v1(15.88,16.64) 15.88,11.18 13.85,9.15 KEY2.4 ; U1.27 v1(18.67,24.25)
  Bottom Layer w0.254: v1(18.67,24.25) 17.65,24.25 15.88,22.48 v1(15.88,16.64)
BUZ: length 46.3
  Top Layer w0.254: BUZZER1.1 74.5,11.68 57.53,11.68 54.74,14.48 48.26,14.48 46.11,16.63 U1.8
CMD: length 44.8
  Top Layer w0.254: U1.18 v1(32.26,27.43) ; R3.2 v1(65.66,45.97)
  Bottom Layer w0.254: v1(32.26,27.43) 42.42,37.59 50.55,37.59 55.25,42.29 61.72,42.29 65.41,45.97 v1(65.66,45.97)
CONFIG: length 40
  Top Layer w0.254: U1.12 v1(39.75,21.71)
  Bottom Layer w0.254: KEY1.4 67.13,2.96 63.79,6.3 54.92,6.3 51.05,10.16 51.05,12.32 46.61,16.76 42.42,16.76 41.4,17.78 41.4,20.06 v1(39.75,21.71)
DN: length 14.4
  Top Layer w0.128: USB1.B7 7.12,41.14 7.37,40.89 7.37,40.26 7.24,40.14 ; D6.1 14.73,38.03 13.92,37.22 13.79,37.22 12.47,38.54 12.47,38.67 13.06,39.26 13.06,39.39 12.11,40.34 11.99,40.34 11.4,39.75 11.27,39.75 11.01,40 7.37,40 7.24,40.14 ; 7.24,40.14 USB1.A7
DP: length 14.5
  Top Layer w0.128: USB1.A6 6.37,40.6 5.3,40.6 5.21,40.51 5.21,39.75 5.32,39.64 USB1.B6 7.18,39.64 7.27,39.72 10.9,39.72 13.68,36.94 13.92,36.94 14.73,36.13 D6.3
  Top Layer w0.254: USB1.A6 6.95,40.64
IO16: length 7.9
  Top Layer w0.254: U1.9 v1(39.88,17.9) ; SPARE2.1 43.18,14.6 v1(41.4,14.6)
  Bottom Layer w0.254: v1(39.88,17.9) 41.4,16.38 v1(41.4,14.6)
IO17: length 5.7
  Top Layer w0.254: U1.10 42.87,19.17 SPARE1.1
LCD_D4: length 76.7
  Top Layer w0.254: U1.23 v1(25.91,27.43)
  Bottom Layer w0.254: U5.11 49.53,76.71 53.34,76.71 54.36,75.69 54.36,44.96 50.42,41.02 38.48,41.02 25.91,28.45 v1(25.91,27.43)
LCD_D5: length 78.6
  Top Layer w0.254: U1.24 v1(24.64,27.43)
  Bottom Layer w0.254: U5.12 47.63,76.07 52.83,76.07 53.72,75.18 53.72,45.08 50.29,41.66 38.35,41.66 24.64,27.94 v1(24.64,27.43)
LCD_D6: length 80.1
  Top Layer w0.254: U1.25 v1(23.37,27.43)
  Bottom Layer w0.254: U5.13 45.72,75.44 52.45,75.44 53.09,74.8 53.09,45.34 49.91,42.16 38.1,42.16 23.62,27.69
LCD_D7: length 95.5
  Top Layer w0.254: U1.33 20.2,16.76 v1(18.8,16.76)
  Bottom Layer w0.254: v1(18.8,16.76) 20.19,16.76 22.23,18.8 22.23,28.19 22.61,28.57 23.75,28.57 37.85,42.67 49.66,42.67 52.45,45.47 52.45,74.17 51.82,74.8 43.82,74.8 U5.14
LCD_EN: length 75.1
  Top Layer w0.254: U1.22 v1(27.18,27.43)
  Bottom Layer w0.254: v1(27.18,27.43) 27.18,28.7 38.99,40.51 50.67,40.51 54.93,44.77 54.93,75.56 55.11,75.74 57.66,75.74 U5.6
LCD_RS: length 80.2
  Top Layer w0.254: U1.21 v1(28.45,27.43) ; U5.4 65.51,67.16 63.25,64.9 59.82,64.9 57.15,62.23 55.63,62.23 54.86,61.47 54.86,53.47 55.75,52.58 55.75,48.39 54.99,47.62 53.21,47.62 48.51,42.93 38.86,42.93 36.99,41.06 v1(36.99,34.32)
  Bottom Layer w0.254: v1(28.45,27.43) 28.45,28.32 32.64,32.51 35.18,32.51 v1(36.99,34.32)
MCU_RESET: length 33
  Top Layer w0.254: TEST4.1 61.41,7.8 58.82,5.21 C1.2 58.79,2.13 R2.1 57.87,2.03 57.07,2.83 KEY3.4 55.72,2.83 48.26,10.28 U1.3
NEO: length 33.7
  Top Layer w0.254: LED1.4 66.85,16.13 49.02,16.13 44.71,20.44 U1.11
OUT_COMMON: length 32.7
  Bottom Layer w2.54: U8.3 18.07,60.11 19.81,61.85 ; U8.2 16.55,65.11 19.81,61.85 ; 19.81,61.85 39.1,61.85 K1.5
OUT_NC: length 11.1
  Top Layer w2.54: U8.4 24.42,55.11 25.03,55.72
OUT_NO: length 11.8
  Top Layer w2.54: U8.1 22.64,70.11 25.03,67.72
POW+: length 21.6
  Top Layer w0.254: R7.1 63.11,32.64 U4.5 ; R7.1 62.45,32.01 60.4,34.07 58.77,34.07 57.91,34.92 C10.1 57.91,37.22 57.06,38.07 56.42,38.07 TEST1.1 54.75,43.01 54.1,43.66 D8.1 ; R7.1 C11.2
RFID_MISO: length 18.3
  Top Layer w0.254: P1.4 4.09,22.61 4.99,21.71 U1.29
RFID_MOSI: length 18.1
  Top Layer w0.254: P1.3 4.09,20.07 4.47,20.44 U1.30
RFID_RST: length 23.5
  Top Layer w0.254: P1.7 2.56,30.23 4.95,27.84 4.95,23.49 5.47,22.98 U1.28
RFID_SCK: length 18.6
  Top Layer w0.254: P1.2 3.57,17.53 5.21,19.17 U1.31
RFID_SDA: length 19.1
  Top Layer w0.254: P1.1 4.06,14.99 6.98,17.9 U1.32
SPARE3: length 83.3
  Top Layer w0.254: v1(34.54,31.5) 37.34,31.5 39.5,29.34 50.8,29.34 v1(53.59,32.13) ; v1(74.93,64.87) 74.95,64.89 R13.1 80.4,64.89 80.76,64.52 R14.2 ; U1.20 v1(29.72,27.43)
  Bottom Layer w0.254: v1(53.59,32.13) 57.4,32.13 73.91,48.64 v1(73.91,62.1) 73.91,63.86 v1(74.93,64.87) ; v1(34.54,31.5) 33.78,31.5 v1(29.72,27.43)
USB-D+: length 38
  Top Layer w0.128: 38.78,27.45 38.78,27.62 35.71,30.69 31.35,30.69 31.26,30.6 31.26,30.42 31.01,30.16 29.43,30.16 29.18,30.42 29.18,30.6 29.09,30.69 28.42,30.69 28.33,30.6 28.33,30.06 28.23,29.97 26.89,29.97 26.8,30.06 26.8,30.6 26.71,30.69 24.87,30.69 24.74,30.82 24.74,36.73 24.71,36.75 18.97,36.75 18.42,36.19 17.97,36.19 D6.4 ; 38.78,27.45 39.7,26.52 39.7,24 39.52,23.82 39.27,23.82 38.84,24.25 U1.14 ; 38.78,27.45 37.16,27.45 37.15,27.43
USB-D-: length 37.9
  Top Layer w0.128: U1.13 38.01,23.16 39.02,23.16 39.27,23.41 39.69,23.41 40.11,23.83 40.11,24.53 ; 40.11,24.53 40.11,26.69 35.83,30.97 31.23,30.97 30.98,30.72 30.98,30.53 30.89,30.44 29.55,30.44 29.46,30.53 29.46,30.72 29.2,30.97 25.15,30.97 25.02,31.1 25.02,36.95 24.88,37.08 19.13,37.08 18.18,38.03 D6.6 ; 40.11,24.53 40.29,24.71 41.02,24.71 C3.2
$1N85: length 60
  Top Layer w0.254: U6.3 v1(68.07,50.67)
  Top Layer w1: v1(60.96,71.12) 60.96,73.28 58.67,75.56 D1.1 40.51,75.46 40.51,71 K1.1
  Bottom Layer w0.254: v1(60.96,71.12) 64.77,71.12 68.07,67.82 v1(68.07,50.67)
$1N86: length 13.4
  Top Layer w0.254: R3.1 72.15,45.97 R1.1 73.42,45.86 74.17,46.61 74.17,48.91 72.02,51.05 71.91,51.16 U6.1
$1N90: length 11.2
  Top Layer w0.254: J2.1 64.77,22.76 64.77,20.95 66.55,19.18 v1(66.55,18.77) D2.1
  Bottom Layer w0.254: LED1.2 66.28,18.5 v1(66.55,18.77)
$1N15737: length 2.6
  Top Layer w0.254: U4.1 68.46,31.69 68.96,32.19
$1N15956: length 1.8
  Top Layer w0.254: R7.2 64.19,33.52 U4.4
$1N24952: length 3.9
  Top Layer w0.254: USB1.B5 9.56,38.64 9.6,38.6 R12.2
$1N25390: length 4
  Top Layer w0.254: R10.1 8.14,41.92 7.87,41.66 6.42,41.66 USB1.A5
$1N26975: length 12.3
  Top Layer w0.254: U5.3 68.05,71.15 71.37,67.82 71.37,67.56
$1N52138: length 11.4
  Top Layer w0.254: 65.08,36.51 65.08,32.24 64.53,31.69 U4.6 ; 65.08,36.51 66.13,35.46 67.04,35.46 68.91,33.59 C9.2 ; 65.08,36.51 L1.1
$1N52395: length 6.6
  Top Layer w0.254: 66.04,33.53 65.53,33.02 65.53,30.9 66.94,29.49 R9.2 66.94,28.39 66.92,28.37 R11.2
$1N56060: length 24.8
  Top Layer w0.254: R13.2 78.69,63.38 78.58,63.27 J1.1 ; 76.2,63.37 74.68,63.37 73.66,64.39 60.92,64.39 U9.3
$1N59600: length 3.4
  Top Layer w0.254: R14.1 76.51,60.58 76.51,60.57 R15.1
$1N59649: length 13.4
  Top Layer w0.254: 66.83,54.99 65.11,56.71 D7.2 59.7,58.17 U9.4
$1N59700: length 16.2
  Top Layer w0.254: U9.2 54.1,62.57 54.1,50.33 53.98,50.21

## Copper pours and planes (outline as drawn; the poured copper is in the pictures)
GND on Bottom Layer: 54.48,82.64 83.57,82.64 83.57,43.8 54.48,43.8
GND on Bottom Layer: 0,43.97 83.57,43.97 83.57,-0.51 0,-0.51

## Text on the board
Bottom Silkscreen Layer: BOOT | RESET | CONFIG | HIGH VOLTAGE ! / PERICOLO TENSIONE !
Document Layer: Board requires >2oz copper/ft^2
Top Silkscreen Layer: Solder J1 if: / - EXT is Output / - EXT is 3V3 Input | GND 3V3 D7  D6  D5  D4 | BOOT | RESET | GND Buzzer + | MAX 40Vdc / on POW+ | LDO 3V3 | +POW | +5V | GND | EXT | Buck 5V | Command | HW REV 1.3 / Aug 2024 | MAX 230Vac / MAX 15A NC | COM | NC | NO | HIGH VOLTAGE! / PERICOLO TENSIONE!
